# EAGLE board Modulator_V1p2 (EAGLE 9.6.2), part 1 of 2
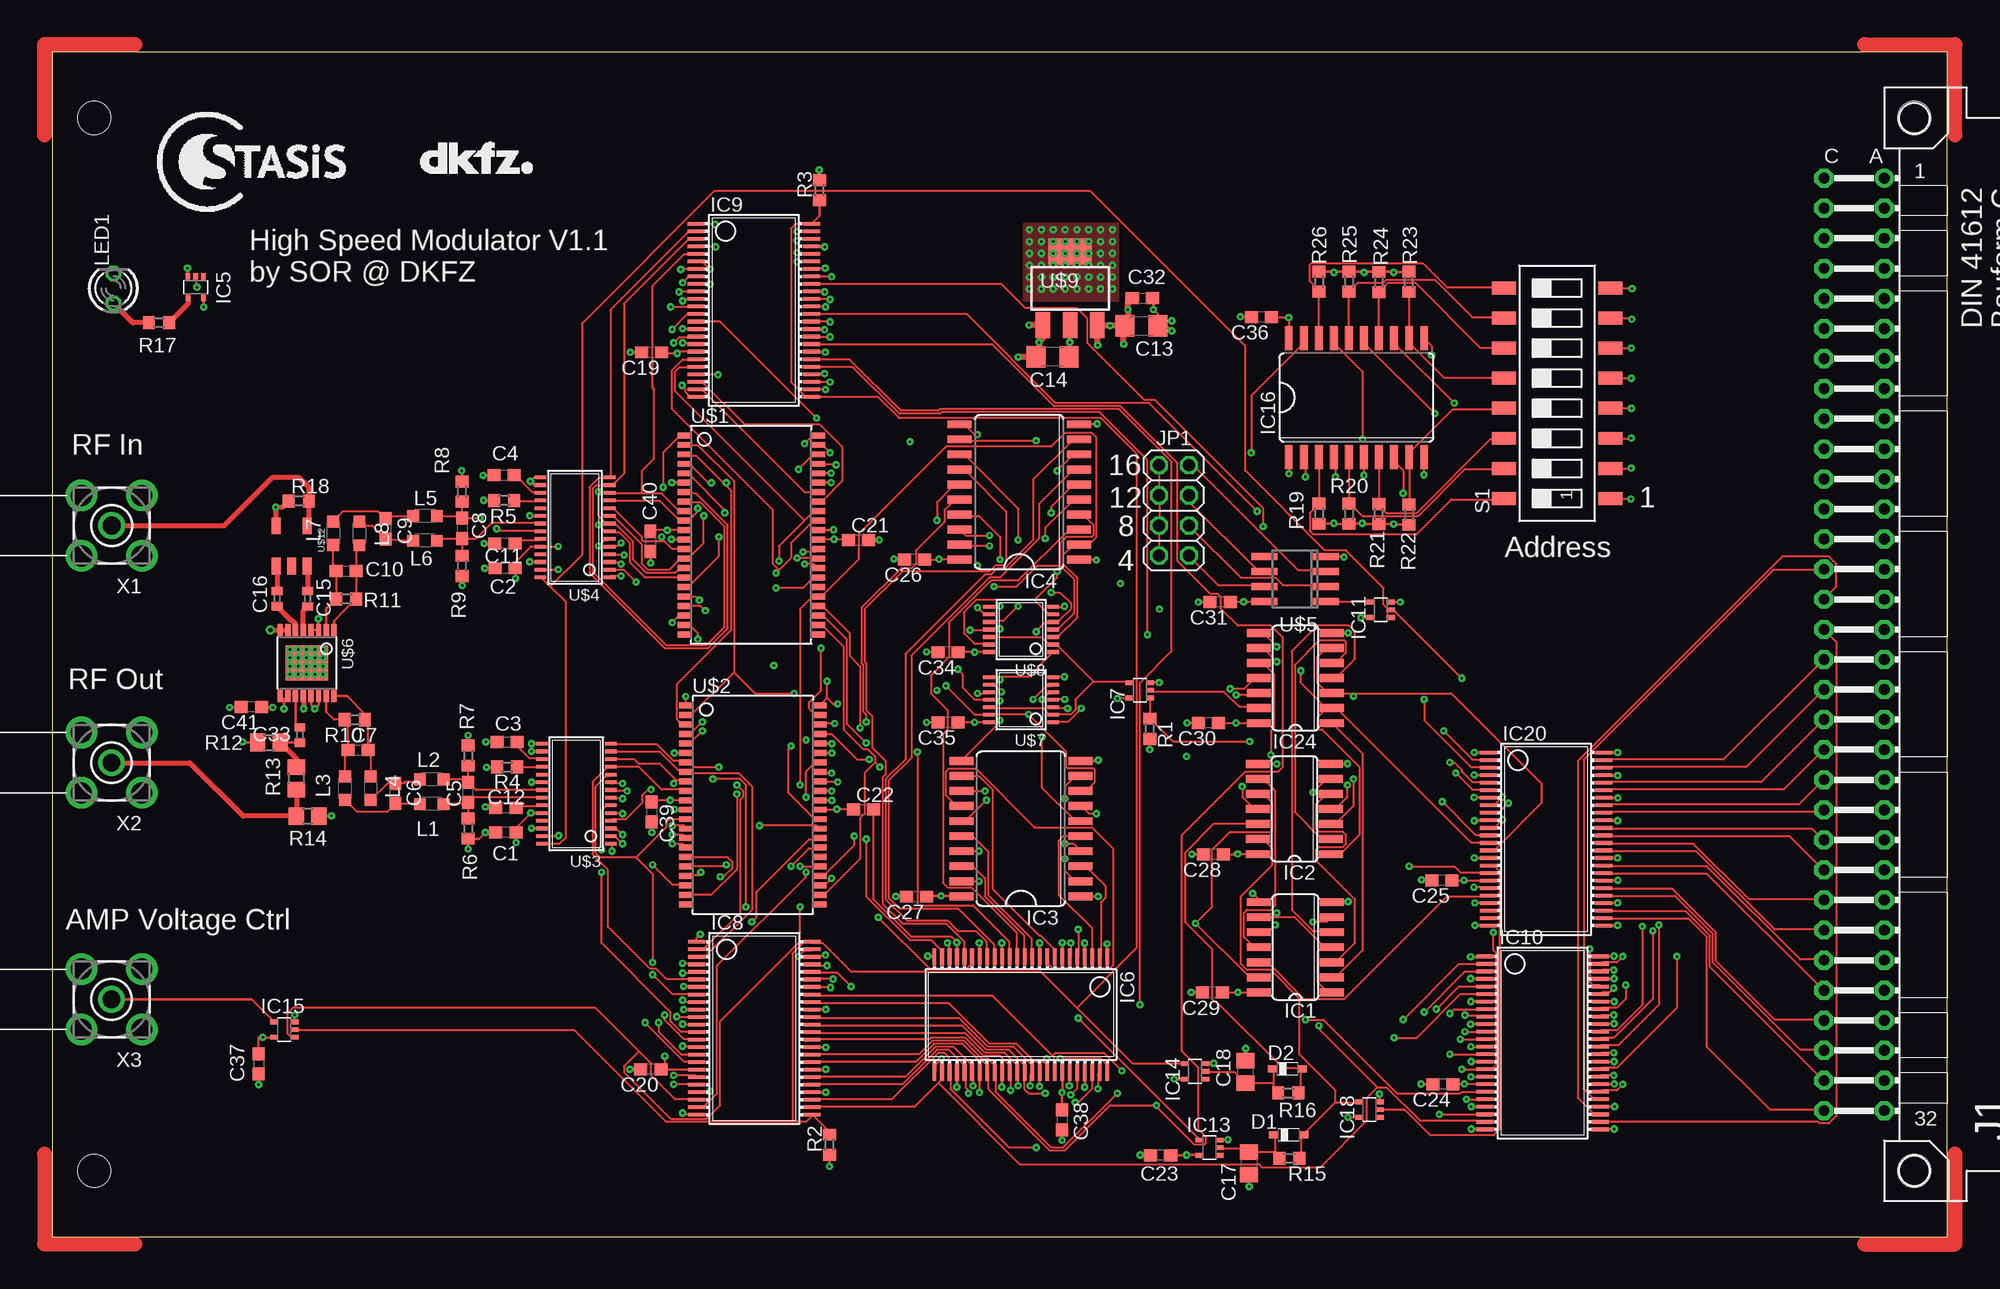
[diagram p5: board, top side]
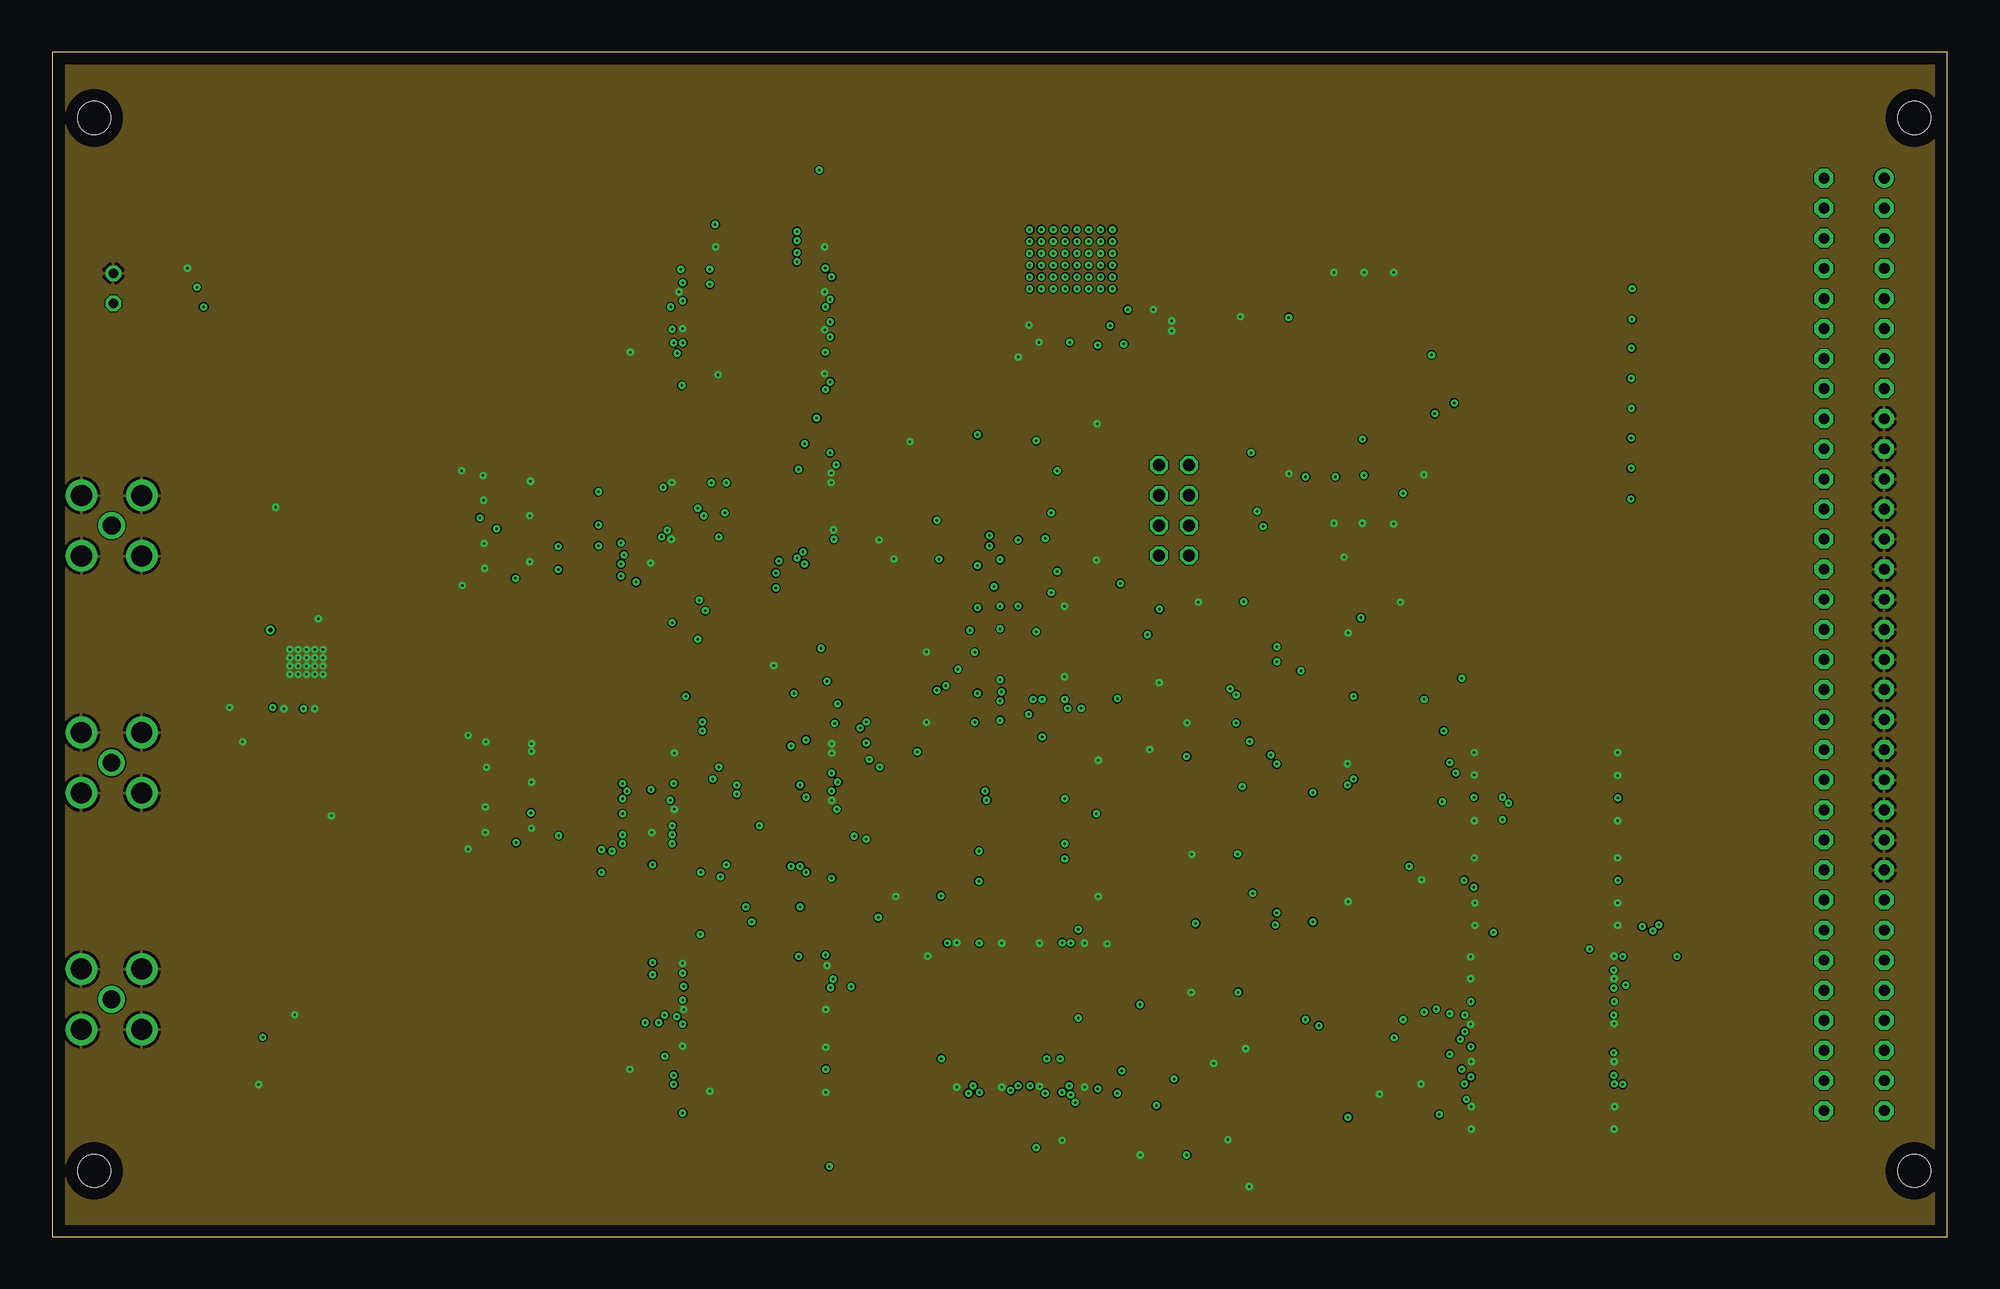
[diagram p6: board, inner layer GND]
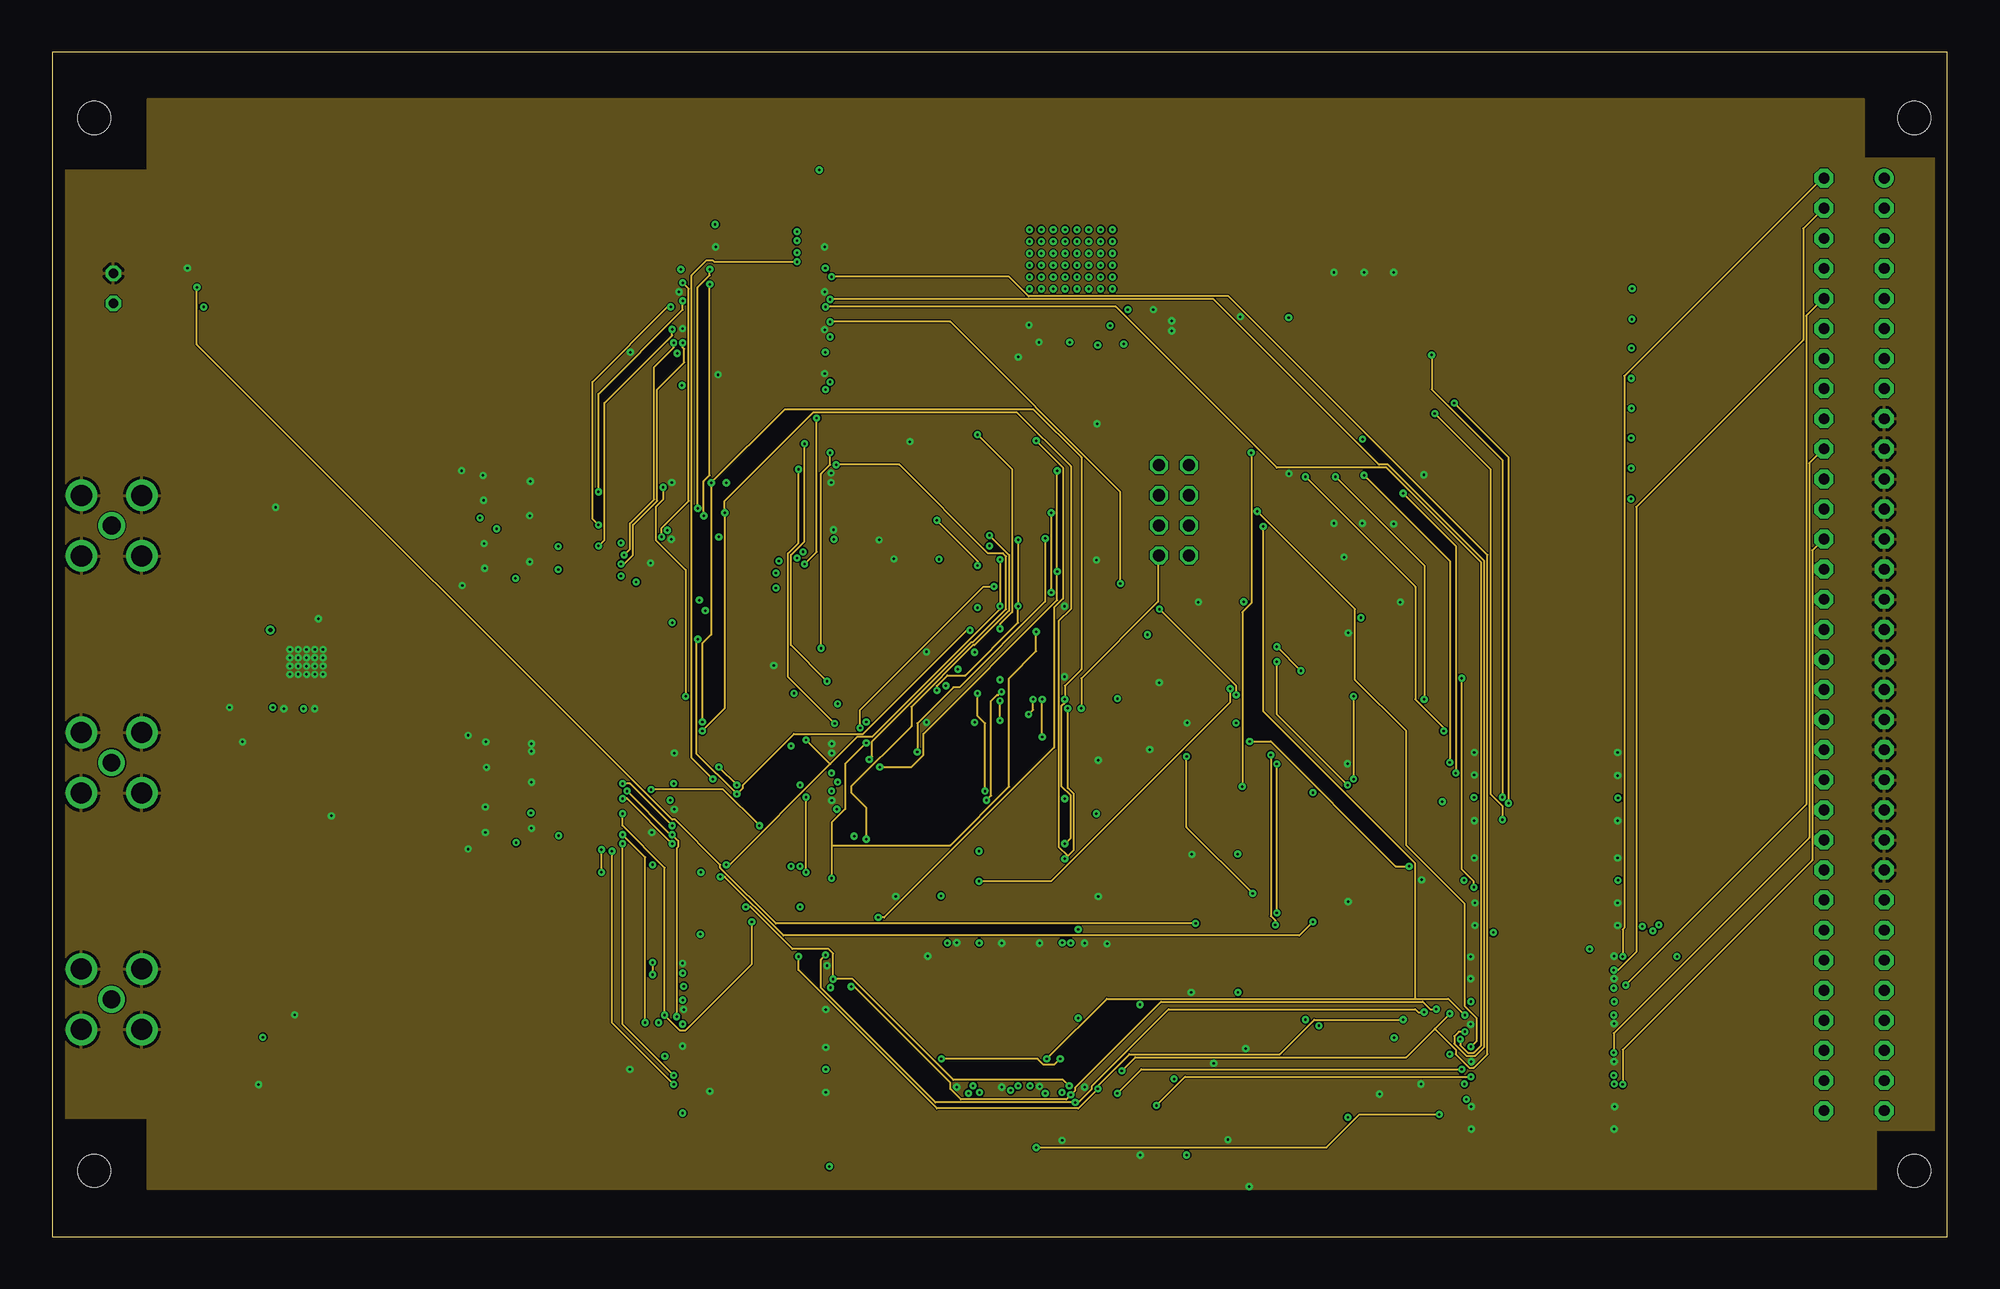
[diagram p7: board, inner layer Route3]
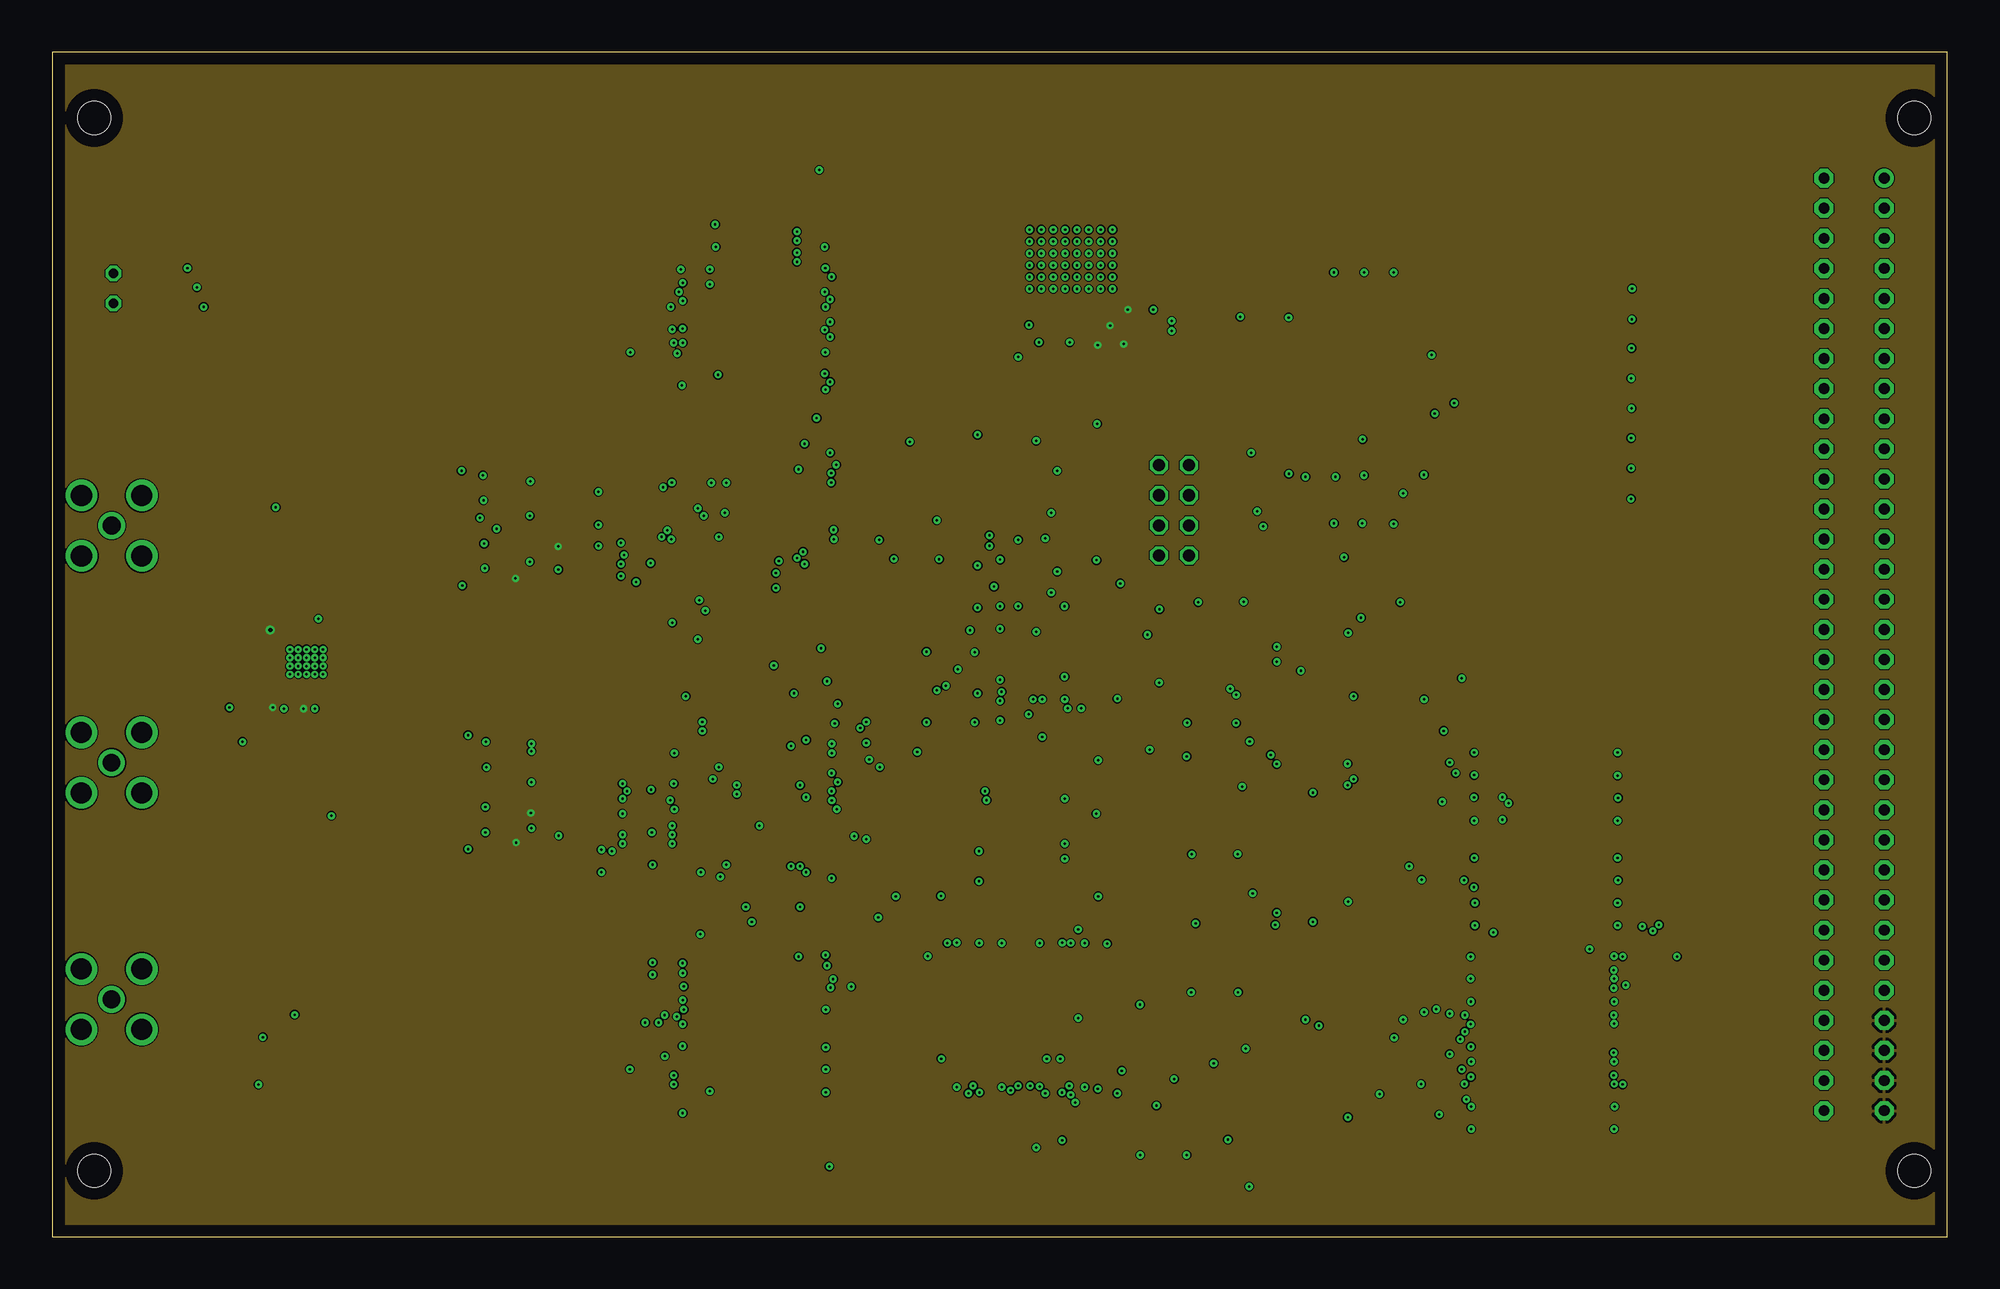
[diagram p8: board, inner layer 5V]
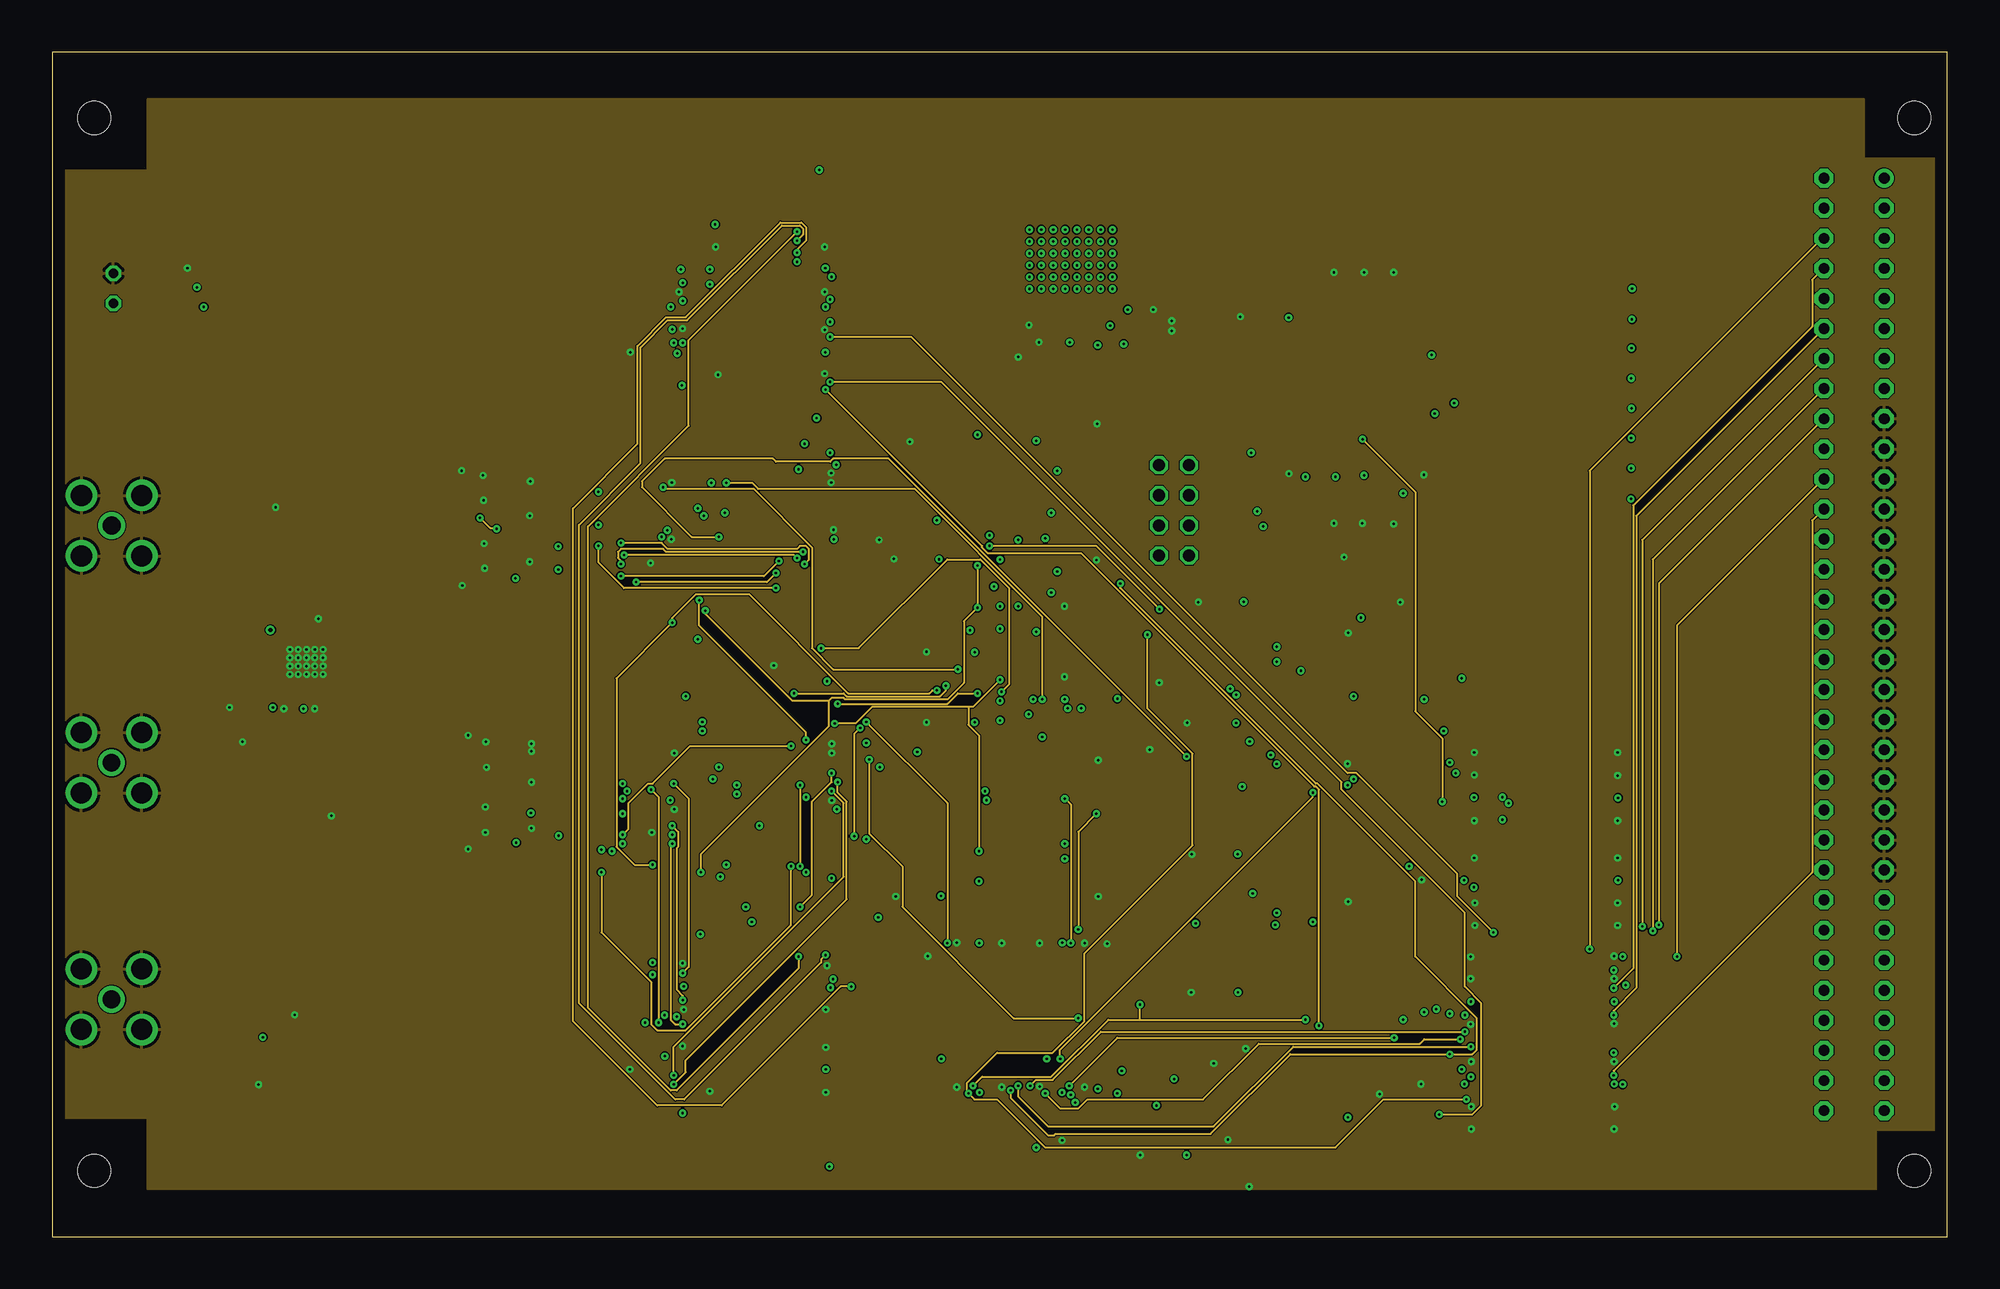
[diagram p9: board, inner layer Route15]
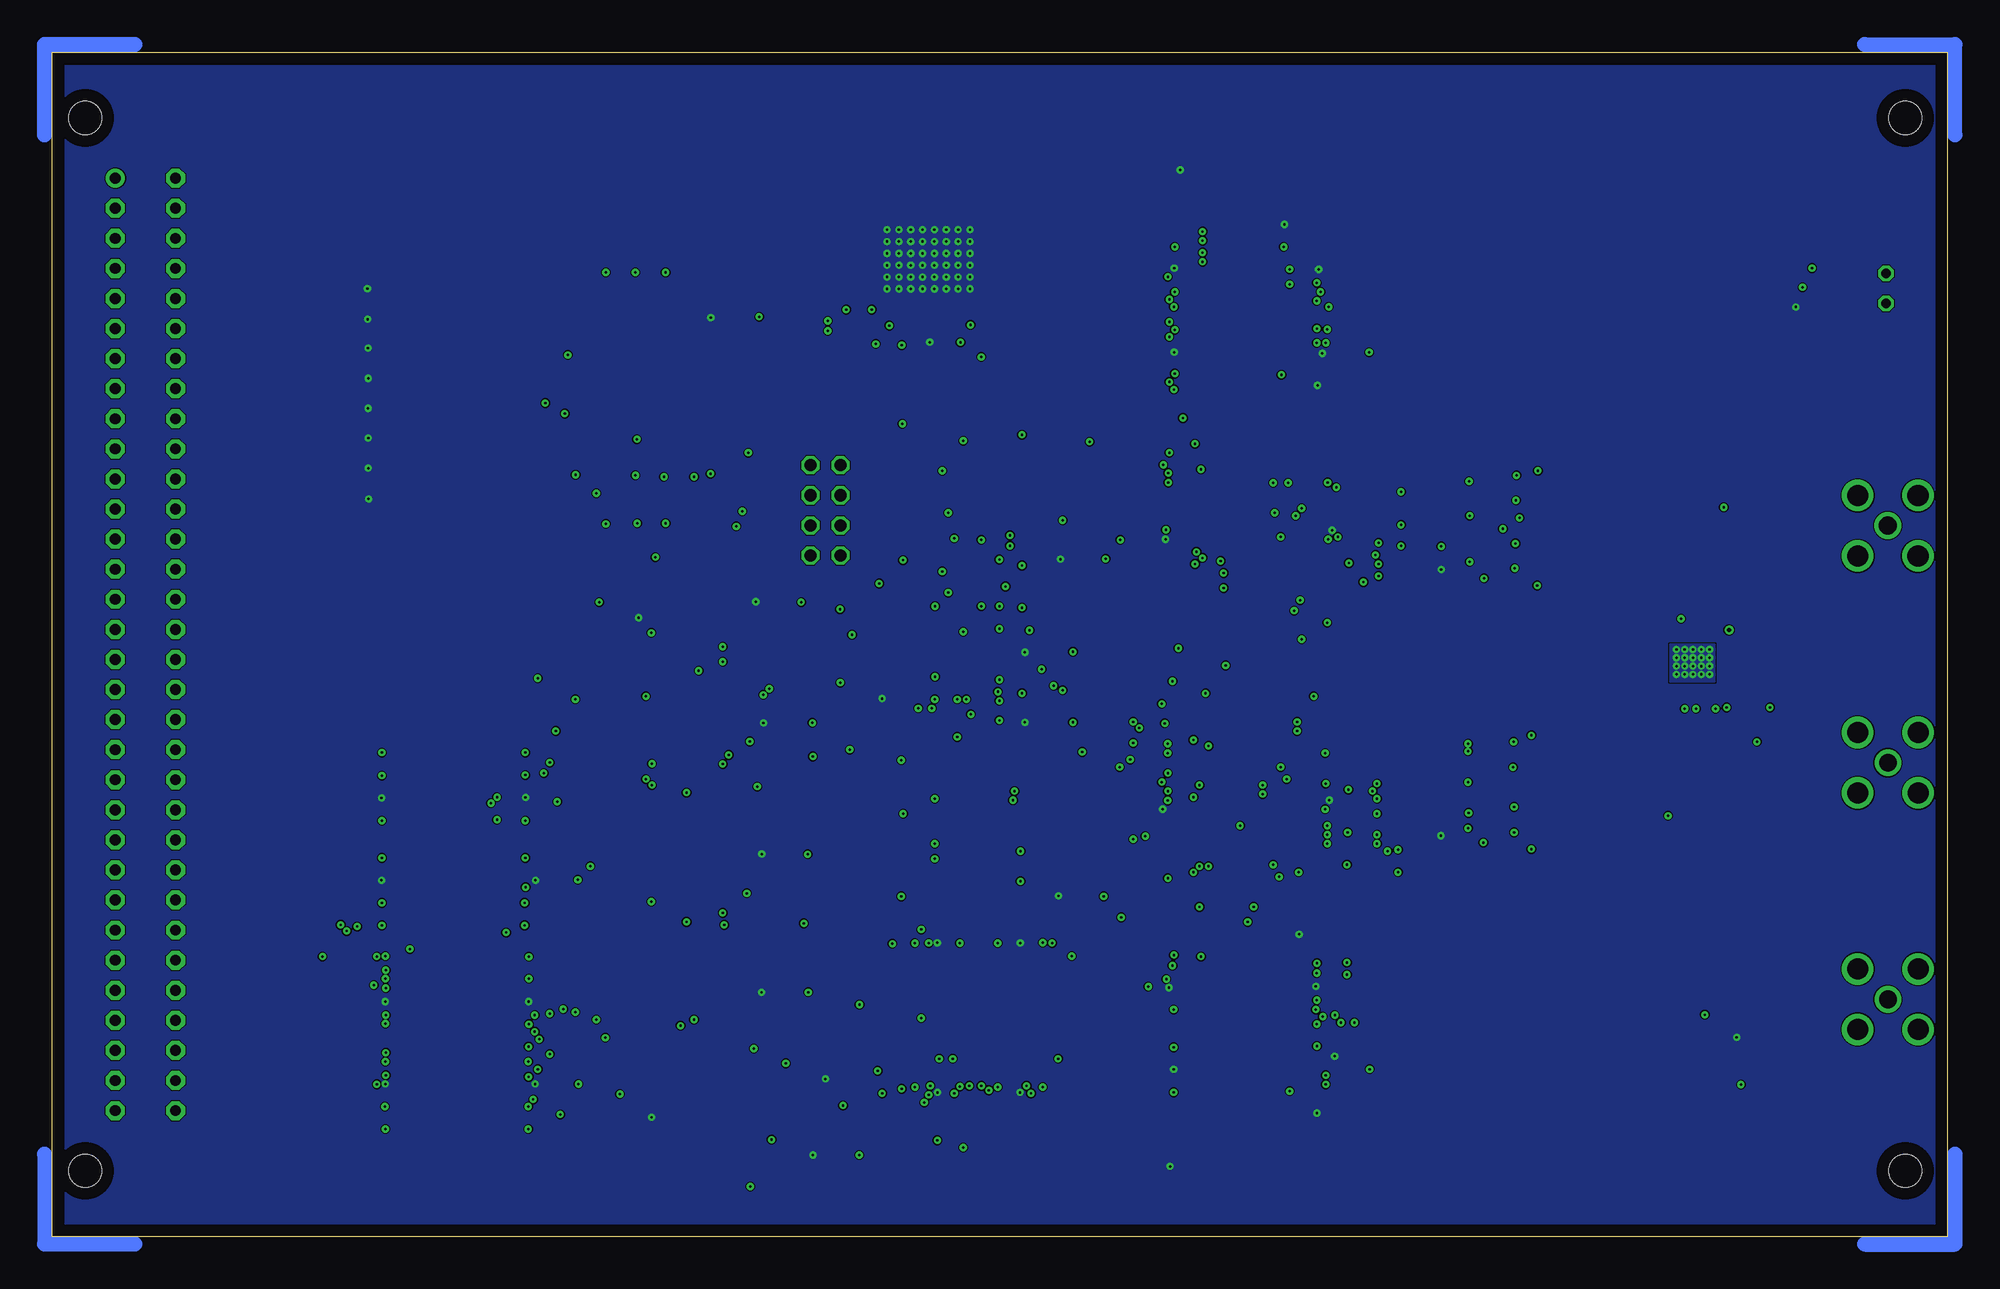
[diagram p10: board, bottom side, seen from below]

Size 160.02 x 100.03 mm. Coordinates in mm from the lower left corner, seen from the top.
Copper layers (1+2*3+14*15+16): Top 0.035mm / dielectric 0.23mm / GND 0.035mm / dielectric 0.3mm / Route3 0.035mm / dielectric 0.34mm / 5V 0.035mm / dielectric 0.3mm / Route15 0.035mm / dielectric 0.23mm / VCC 0.035mm
Design rules "default *": minimum track width 6mil, minimum drill 0.2mm, track to track 4mil, track to pad 4mil, pad to pad 4mil, via to via 4mil, smd to smd 0mil, copper to edge 40mil, drill to drill 6mil, minimum pad ring 10mil, minimum via ring 8mil, stop-mask expansion 4mil, vias tented up to drill 100mil, thermal gap 10mil

## Footprints (pad centres in the part's own frame; a part is rotated, then mirrored left to right if it is on the bottom)
C0603 = smd 1.1 x 1: 1 -0.85,0; 2 0.85,0
C1206 = smd 1.6 x 1.8: 1 -1.4,0; 2 1.4,0
C0402 = smd 0.7 x 0.9: 1 -0.65,0; 2 0.65,0
C0805 = smd 1.3 x 1.5: 1 -0.95,0; 2 0.95,0
SOD323_ST = smd 0.8 x 0.6: A 1.25,0; C -1.25,0
SO14 = smd 0.66 x 2.032: 1 -3.81,-3.073; 2 -2.54,-3.073; 3 -1.27,-3.073; 4 0,-3.073; 5 1.27,-3.073; 6 2.54,-3.073; 7 3.81,-3.073; 8 3.81,3.073; 9 2.54,3.073; 10 1.27,3.073; 11 0,3.073; 12 -1.27,3.073; 13 -2.54,3.073; 14 -3.81,3.073
SO20W = smd 0.66 x 2.032: 1 -5.715,-5.029; 2 -4.445,-5.029; 3 -3.175,-5.029; 4 -1.905,-5.029; 5 -0.635,-5.029; 6 0.635,-5.029; 7 1.905,-5.029; 8 3.175,-5.029; 9 4.445,-5.029; 10 5.715,-5.029; 11 5.715,5.029; 12 4.445,5.029; 13 3.175,5.029; 14 1.905,5.029; 15 0.635,5.029; 16 -0.635,5.029; 17 -1.905,5.029; 18 -3.175,5.029; 19 -4.445,5.029; 20 -5.715,5.029
SC70-5 = smd 0.4 x 0.7: 1 -0.65,-0.85; 2 0,-0.85; 3 0.65,-0.85; 4 0.65,0.85; 5 -0.65,0.85
SSOP48DL = smd 0.305 x 1.422: 1 -6.985,-4.877; 2 -6.35,-4.877; 3 -5.715,-4.877; 4 -5.08,-4.877; 5 -4.445,-4.877; 6 -3.81,-4.877; 7 -3.175,-4.877; 8 -2.54,-4.877; 9 -1.905,-4.877; 10 -1.27,-4.877; 11 -0.635,-4.877; 12 0,-4.877; 13 0.635,-4.877; 14 1.27,-4.877; 15 1.905,-4.877; 16 2.54,-4.877; 17 3.175,-4.877; 18 3.81,-4.877; 19 4.445,-4.877; 20 5.08,-4.877; 21 5.715,-4.877; 22 6.35,-4.877; 23 6.985,-4.877; 24 7.62,-4.877; 25 7.62,4.877; 26 6.985,4.877; 27 6.35,4.877; 28 5.715,4.877; 29 5.08,4.877; 30 4.445,4.877; 31 3.81,4.877; 32 3.175,4.877; 33 2.54,4.877; 34 1.905,4.877; 35 1.27,4.877; 36 0.635,4.877; 37 0,4.877; 38 -0.635,4.877; 39 -1.27,4.877; 40 -1.905,4.877; 41 -2.54,4.877; 42 -3.175,4.877; 43 -3.81,4.877; 44 -4.445,4.877; 45 -5.08,4.877; 46 -5.715,4.877; 47 -6.35,4.877; 48 -6.985,4.877
VG64B = drill 0.914 pad 1.6: A1 154.94,39.37 | drill 0.914 pad 1.6 octagon: A2 154.94,36.83; A3 154.94,34.29; A4 154.94,31.75; A5 154.94,29.21; A6 154.94,26.67; A7 154.94,24.13; A8 154.94,21.59; A9 154.94,19.05; A10 154.94,16.51; A11 154.94,13.97; A12 154.94,11.43; A13 154.94,8.89; A14 154.94,6.35; A15 154.94,3.81; A16 154.94,1.27; A17 154.94,-1.27; A18 154.94,-3.81; A19 154.94,-6.35; A20 154.94,-8.89; A21 154.94,-11.43; A22 154.94,-13.97; A23 154.94,-16.51; A24 154.94,-19.05; A25 154.94,-21.59; A26 154.94,-24.13; A27 154.94,-26.67; A28 154.94,-29.21; A29 154.94,-31.75; A30 154.94,-34.29; A31 154.94,-36.83; A32 154.94,-39.37; C1 149.86,39.37; C2 149.86,36.83; C3 149.86,34.29; C4 149.86,31.75; C5 149.86,29.21; C6 149.86,26.67; C7 149.86,24.13; C8 149.86,21.59; C9 149.86,19.05; C10 149.86,16.51; C11 149.86,13.97; C12 149.86,11.43; C13 149.86,8.89; C14 149.86,6.35; C15 149.86,3.81; C16 149.86,1.27; C17 149.86,-1.27; C18 149.86,-3.81; C19 149.86,-6.35; C20 149.86,-8.89; C21 149.86,-11.43; C22 149.86,-13.97; C23 149.86,-16.51; C24 149.86,-19.05; C25 149.86,-21.59; C26 149.86,-24.13; C27 149.86,-26.67; C28 149.86,-29.21; C29 149.86,-31.75; C30 149.86,-34.29; C31 149.86,-36.83; C32 149.86,-39.37 | hole 2.794: 157.48,44.45; 157.48,-44.45; 3.81,-44.45; 3.81,44.45
2X04 = drill 1.016 octagon: 1 -3.81,-1.27; 2 -3.81,1.27; 3 -1.27,-1.27; 4 -1.27,1.27; 5 1.27,-1.27; 6 1.27,1.27; 7 3.81,-1.27; 8 3.81,1.27
L2012C = smd 1 x 1: 1 -1,0; 2 1,0
LED3MM = drill 0.813 octagon: A -1.27,0; K 1.27,0
R0603 = smd 1 x 1.1: 1 -0.85,0; 2 0.85,0
R0805 = smd 1.3 x 1.5: 1 -0.95,0; 2 0.95,0
SMS-008 = smd 1.092 x 2.007: 1 -8.89,-4.496; 2 -6.35,-4.496; 3 -3.81,-4.496; 4 -1.27,-4.496; 5 1.27,-4.496; 6 3.81,-4.496; 7 6.35,-4.496; 8 8.89,-4.496; 9 8.89,4.496; 10 6.35,4.496; 11 3.81,4.496; 12 1.27,4.496; 13 -1.27,4.496; 14 -3.81,4.496; 15 -6.35,4.496; 16 -8.89,4.496
TSOPII-Z44 = smd 0.5 x 1.2: 1 -8.4,-5.627; 2 -7.6,-5.627; 3 -6.8,-5.627; 4 -6,-5.627; 5 -5.2,-5.627; 6 -4.4,-5.627; 7 -3.6,-5.627; 8 -2.8,-5.627; 9 -2,-5.627; 10 -1.2,-5.627; 11 -0.4,-5.627; 12 0.4,-5.627; 13 1.2,-5.627; 14 2,-5.627; 15 2.8,-5.627; 16 3.6,-5.627; 17 4.4,-5.627; 18 5.2,-5.627; 19 6,-5.627; 20 6.8,-5.627; 21 7.6,-5.627; 22 8.4,-5.627; 23 8.4,5.627; 24 7.6,5.627; 25 6.8,5.627; 26 6,5.627; 27 5.2,5.627; 28 4.4,5.627; 29 3.6,5.627; 30 2.8,5.627; 31 2,5.627; 32 1.2,5.627; 33 0.4,5.627; 34 -0.4,5.627; 35 -1.2,5.627; 36 -2,5.627; 37 -2.8,5.627; 38 -3.6,5.627; 39 -4.4,5.627; 40 -5.2,5.627; 41 -6,5.627; 42 -6.8,5.627; 43 -7.6,5.627; 44 -8.4,5.627
TSSOP28 = smd 0.305 x 0.991: 1 -4.225,-2.918; 2 -3.575,-2.918; 3 -2.925,-2.918; 4 -2.275,-2.918; 5 -1.625,-2.918; 6 -0.975,-2.918; 7 -0.325,-2.918; 8 0.325,-2.918; 9 0.975,-2.918; 10 1.625,-2.918; 11 2.275,-2.918; 12 2.925,-2.918; 13 3.575,-2.918; 14 4.225,-2.918; 15 4.225,2.918; 16 3.575,2.918; 17 2.925,2.918; 18 2.275,2.918; 19 1.625,2.918; 20 0.975,2.918; 21 0.325,2.918; 22 -0.325,2.918; 23 -0.975,2.918; 24 -1.625,2.918; 25 -2.275,2.918; 26 -2.925,2.918; 27 -3.575,2.918; 28 -4.225,2.918
SO-08 = smd 0.6 x 2.2: 1 -1.905,-2.6; 2 -0.635,-2.6; 3 0.635,-2.6; 4 1.905,-2.6; 5 1.905,2.6; 6 0.635,2.6; 7 -0.635,2.6; 8 -1.905,2.6
TSSOP16EXP = smd 0.45 x 1.05: 1 -2.275,-2.768; 2 -1.625,-2.768; 3 -0.975,-2.768; 4 -0.325,-2.768; 5 0.325,-2.768; 6 0.975,-2.768; 7 1.625,-2.768; 8 2.275,-2.768; 9 2.275,2.768; 10 1.625,2.768; 11 0.975,2.768; 12 0.325,2.768; 13 -0.325,2.768; 14 -0.975,2.768; 15 -1.625,2.768; 16 -2.275,2.768 | smd 3.58 x 2.94: EXP 0,0
TSSOP14 = smd 0.305 x 0.991: 1 -1.905,-2.718; 2 -1.27,-2.718; 3 -0.635,-2.718; 4 0,-2.718; 5 0.635,-2.718; 6 1.27,-2.718; 7 1.905,-2.718; 8 1.905,2.718; 9 1.27,2.718; 10 0.635,2.718; 11 0,2.718; 12 -0.635,2.718; 13 -1.27,2.718; 14 -1.905,2.718
SOT223 = smd 1.219 x 2.235: 1 -2.311,-3.099; 2 0,-3.099; 3 2.311,-3.099 | smd 3.6 x 2.2: 4 0,3.099
ETC1-1-13 = smd 1.4 x 0.76: P$1 1.7,1.3; P$2 1.7,0; P$3 1.7,-1.3; P$4 -1.7,-1.3; P$5 -1.7,1.3
BU-SMA-H = drill 1.5: 1 0,0 | drill 1.778: 2 -2.55,2.55; 3 2.55,2.55; 4 2.55,-2.55; 5 -2.55,-2.55

## Placement (x,y rotation side)
C1  100nF  [C0603]  38.31,34.12 180 top
C2  100nF  [C0603]  38.25,56.44 180 top
C3  100nF  [C0603]  38.41,41.78 0 top
C4  100nF  [C0603]  38.17,64.3 0 top
C5  110pF  [C0603]  35.13,37.52 90 top
C6  270pF  [C0603]  28.98,37.43 90 top
C7  220pF  [C0603]  25.85,41.09 0 top
C8  110pF  [C0603]  34.61,59.81 270 top
C9  270pF  [C0603]  28.17,59.77 270 top
C10  220pF  [C0603]  24.83,56.21 0 top
C11  100nF  [C0603]  38.23,58.53 180 top
C12  100nF  [C0603]  38.31,36.21 180 top
C13  10µF  [C1206]  91.97,76.91 0 top
C14  22µF  [C1206]  84.46,74.29 180 top
C15  10nF  [C0402]  21.58,53.86 270 top
C16  10nF  [C0402]  19,53.87 270 top
C17  1nF  [C0805]  101.05,6.19 270 top
C18  1nF  [C0805]  100.77,13.91 90 top
C19  100nF  [C0603]  50.63,74.67 180 top
C20  100nF  [C0603]  50.55,14.13 180 top
C21  10nF  [C0603]  68.1,58.83 0 top
C22  10nF  [C0603]  68.51,36.07 0 top
C23  10nF  [C0603]  93.6,6.87 180 top
C24  10nF  [C0603]  117.43,12.87 180 top
C25  10nF  [C0603]  117.36,30.09 180 top
C26  10nF  [C0603]  72.83,57.19 180 top
C27  10nF  [C0603]  73,28.71 180 top
C28  10nF  [C0603]  98.05,32.27 180 top
C29  10nF  [C0603]  97.96,20.61 180 top
C30  10nF  [C0603]  97.63,43.37 180 top
C31  10nF  [C0603]  98.63,53.58 180 top
C32  10nF  [C0603]  92.05,79.25 0 top
C33  10nF  [C0402]  20.93,42.35 270 top
C34  10nF  [C0603]  75.65,49.35 180 top
C35  10nF  [C0603]  75.65,43.43 180 top
C36  10nF  [C0603]  102.11,77.65 180 top
C37  10nF  [C0603]  17.43,14.59 270 top
C38  10nF  [C0603]  85.27,9.85 270 top
C39  10nF  [C0603]  50.61,35.85 270 top
C40  10nF  [C0603]  50.51,58.71 270 top
C41  10nF  [C0603]  16.83,44.73 180 top
D1  BAT60J  [SOD323_ST]  104.41,8.6 0 top
D2  BAT60J  [SOD323_ST]  104.29,14.16 0 top
IC1  74ALVC00  [SO14]  104.98,24.44 90 top
IC2  SN74LVC04ANS  [SO14]  104.9,36.11 90 top
IC3  74HC688DW  [SO20W]  81.8,34.45 90 top
IC4  74HC688DW  [SO20W]  81.66,62.88 90 top
IC5  74LVC1G17DCK  [SC70-5]  12.13,80.18 180 top
IC6  SN74LVC16373  [SSOP48DL]  82.12,18.74 180 top
IC7  SN74LVC1G32IDCKREP  [SC70-5]  91.84,46.13 90 top
IC8  SN74CB3Q16245DLR  [SSOP48DL]  59.3,17.91 270 top
IC9  SN74CB3Q16245DLR  [SSOP48DL]  59.24,78.54 270 top
IC10  SN74LVCH16244ADLR  [SSOP48DL]  125.86,16.68 270 top
IC11  74LVC1G04DCK  [SC70-5]  112.18,52.93 90 top
IC13  74LVC1G17DCK  [SC70-5]  97.72,7.51 90 top
IC14  74LVC1G17DCK  [SC70-5]  96.5,13.95 90 top
IC15  74LVC1G08DCK  [SC70-5]  19.6,17.49 90 top
IC16  74HC688DW  [SO20W]  110.13,70.86 0 top
IC18  74LVC1G17DCK  [SC70-5]  111.23,10.73 90 top
IC20  SN74LVCH16244ADLR  [SSOP48DL]  126.14,33.88 270 top
IC24  SN74LVC02AD  [SO14]  104.98,47.17 90 top
J1  BUS  [VG64B]  -0.25,50.01 0 top
JP1  PINHD-2X4  [2X04]  94.73,61.33 90 top
L1  1uH  [L2012C]  32.05,36.52 180 top
L2  1uH  [L2012C]  32.05,38.6 180 top
L3  1.5uH  [L2012C]  24.75,37.87 90 top
L4  1.5uH  [L2012C]  26.91,37.86 90 top
L5  1uH  [L2012C]  31.49,60.84 180 top
L6  1uH  [L2012C]  31.49,58.76 180 top
L7  1.5uH  [L2012C]  23.73,59.39 270 top
L8  1.5uH  [L2012C]  25.95,59.38 270 top
LED1  10mA 2.2-2.4V  [LED3MM]  5.18,80.08 90 top
R1  100k  [R0603]  92.69,42.88 270 top
R2  100k  [R0603]  65.63,7.77 90 top
R3  100k  [R0603]  64.79,88.36 90 top
R4  2k  [R0603]  38.41,39.65 180 top
R5  2k  [R0603]  38.16,62.17 180 top
R6  140  [R0603]  35.13,34.45 270 top
R7  140  [R0603]  35.13,40.62 270 top
R8  140  [R0603]  34.61,62.91 90 top
R9  140  [R0603]  34.61,56.64 90 top
R10  220  [R0603]  25.56,43.65 180 top
R11  220  [R0603]  24.82,53.85 180 top
R12  NP  [R0805]  18.31,41.73 0 top
R13  0  [R0805]  20.63,38.7 90 top
R14  NP  [R0805]  21.57,35.51 0 top
R15  1k  [R0603]  104.48,6.61 180 top
R16  1k  [R0603]  104.38,12.13 180 top
R17  120  [R0603]  9.03,77.18 0 top
R18  50  [R0603]  20.83,62.13 0 top
R19  100k  [R0603]  106.97,61.05 90 top
R20  100k  [R0603]  109.51,61.04 90 top
R21  100k  [R0603]  112.01,61.01 90 top
R22  100k  [R0603]  114.57,60.96 90 top
R23  100k  [R0603]  114.55,80.63 270 top
R24  100k  [R0603]  112.03,80.62 270 top
R25  100k  [R0603]  109.51,80.65 270 top
R26  100k  [R0603]  106.97,80.64 270 top
S1  SWS008  [SMS-008]  127.08,71.22 90 top
U$1  SRAM_64K_16BIT  [TSOPII-Z44]  59.02,59.26 270 top
U$2  SRAM_64K_16BIT  [TSOPII-Z44]  59.16,36.45 270 top
U$3  AD9754  [TSSOP28]  44.26,37.39 90 top
U$4  AD9754  [TSSOP28]  44.15,59.89 90 top
U$5  DS1100LZ-20LZ  [SO-08]  104.95,55.53 90 top
U$6  AD8345E  [TSSOP16EXP]  21.53,48.43 180 top
U$7  74LV393PW  [TSSOP14]  81.82,45.34 90 top
U$8  74LV393PW  [TSSOP14]  81.82,51.27 90 top
U$9  AZ1117IH-3.3TRG1  [SOT223]  85.95,80.07 0 top
U$10  [LOGO_DKFZ]  31.13,89.73 0 top
U$11  [LOGO_STASIS]  17.83,90.53 0 top
U$12  ETC1-1-13  [ETC1-1-13]  20.23,58.33 270 top
X1  SMA_CON-H  [BU-SMA-H]  5.03,60.04 180 top
X2  SMA_CON-H  [BU-SMA-H]  5.02,40.02 180 top
X3  SMA_CON-H  [BU-SMA-H]  5.02,20.04 180 top

## Tracks (layer width: path | path; a pad name or v marks a point on that pad's centre or on a via)
5V  (via drill 0.2, 0.35)
  Top 0.152: U$4.24 41.23,58.28 | 41.23,58.28 v42.73,58.28 | 41.23,58.28 40.44,58.28 39.1,56.94 C2.1 39.13,56.41 v39.13,55.58 | 90.83,78.88 C32.1 | 90.83,77.17 C13.1 90.43,76.91 90.48,76.86 | 89.35,76.91 v89.33,76.93 | 88.3,76.93 88.29,76.94 | 88.29,76.94 U$9.3 | 88.28,76.93 88.29,76.94 | C41.1 18.58,44.73 v18.63,44.68
  Top 0.203: U$3.24 41.32,35.78 v40.43,35.78 39.16,34.51 C1.1 39.18,34.1 v39.18,33.28
  Top 0.406: U$6.7 U$6.8 18.46,51.2 v18.43,51.23 | U$6.12 21.23,45.64 v21.23,44.58
  Top 0.508: 90.83,78.88 v90.83,78.28 90.83,77.17 | 90.43,76.91 89.35,76.91 | v89.33,76.93 88.3,76.93 | v88.28,75.28 88.28,76.93 | v90.48,75.38 90.48,76.86
  pour 5V: 1.03,99.03 1.03,1.03 159.03,1.03 159.03,99.03
A0  (via drill 0.2)
  Top 0.152: v85.75,44.61 84.61,44.61 U$7.3 | v85.5,31.91 85.5,30.89 86.26,30.13 86.77,30.13 IC3.2 | v54.89,42.7 53.87,41.69 53.62,41.69 U$2.5 | v56.8,61.12 56.8,61.37 53.75,64.42 53.49,64.42 U$1.5
  Route3 0.152: v85.75,44.61 85.75,37.88 86.26,37.37 86.26,32.67 85.75,32.16 | v85.5,31.91 85.75,32.16 | v54.89,42.7 56.8,44.61 v56.8,61.12 56.8,62.14 64.29,69.63 81.43,69.63 86,65.06 86,52.99 84.99,51.98 84.99,32.93 85.75,32.16
A1  (via drill 0.2)
  Top 0.152: v85.5,45.37 84.61,45.37 U$7.4 | v85.5,33.18 86.26,33.18 86.77,32.67 IC3.4 | v54.89,43.47 54,42.58 53.62,42.58 U$2.4 | v55.65,63.66 55.4,63.66 53.87,65.18 53.49,65.18 U$1.4
  Route3 0.152: v85.5,33.18 86,33.69 86,37.24 85.24,38.01 85.24,44.86 85.5,45.12 v85.5,45.37 85.5,46.51 86.89,47.91 86.89,65.82 82.83,69.88 61.88,69.88 v55.65,63.66 55.65,50.83 54.89,50.07 v54.89,43.47
A2  (via drill 0.2)
  Top 0.152: v83.59,45.37 84.1,45.88 84.48,45.88 U$7.5 | v83.59,42.2 83.59,37.88 86.26,35.21 86.77,35.21 IC3.6 | 56.8,63.53 54.38,65.95 53.49,65.95 U$1.3 | 56.8,63.53 57.3,63.02 57.3,51.21 52.73,46.64 52.73,43.72 53.11,43.34 53.49,43.34 U$2.3 | 56.8,63.53 v56.92,63.66
  Route3 0.152: v83.59,42.2 v83.59,45.37
  Route15 0.152: v83.59,45.37 83.59,52.36 72.8,63.15 59.59,63.15 59.08,63.66 v56.92,63.66
A3  (via drill 0.2)
  Top 0.152: IC3.8 86.89,37.75 87.4,37.75 88.04,38.39 88.04,39.4 87.91,39.53 85.75,39.53 85.62,39.66 85.62,40.93 v82.45,44.1 79.15,44.1 U$7.13 79.02,44.1 77.88,44.1 v75.46,46.51 | v82.83,45.37 83.97,46.51 84.48,46.51 U$7.6 | 57.56,47.66 54,44.1 53.62,44.1 U$2.2 | 57.56,47.66 57.56,63.79 54.51,66.83 53.49,66.83 U$1.2 | v62.64,45.88 59.34,45.88 57.56,47.66
  Route3 0.152: v82.83,45.37 82.83,44.48 v82.45,44.1
  Route15 0.152: v75.46,46.51 75.46,46.13 74.96,45.63 67.08,45.63 66.83,45.88 v62.64,45.88
A4  (via drill 0.2)
  Top 0.152: v80.04,45.24 79.15,45.24 U$7.11 79.02,45.37 77.88,45.37 76.86,46.39 76.86,47.53 v76.48,47.91 | v80.04,43.59 79.78,43.34 79.78,43.21 76.86,40.29 IC3.11 | v53.49,45.63 53.49,44.86 U$2.1 | v51.59,63.28 51.59,66.2 52.99,67.6 53.37,67.6 U$1.1
  Route3 0.152: v80.04,43.59 v80.04,45.24 | v53.49,45.63 53.49,56.29 50.95,58.83 50.95,61.63 51.59,62.26 v51.59,63.28
  Route15 0.152: v76.48,47.91 65.94,47.91 64.16,49.69 64.16,58.2 59.21,63.15 51.72,63.15 v51.59,63.28
A5  (via drill 0.2)
  Top 0.152: v78.13,45.88 79.02,45.88 U$7.10 | v78.77,37.62 76.86,37.62 IC3.13 | v63.53,66.96 64.16,67.6 64.54,67.6 U$1.44 | 65.43,45.5 v65.43,46.9 | 65.43,45.5 64.8,44.86 U$2.44 | v66.32,44.99 65.94,44.99 65.43,45.5
  Route3 0.152: v78.13,45.88 78.13,43.97 78.77,43.34 v78.77,37.62 | v63.53,66.96 63.53,58.71 62.38,57.56 62.38,49.94 v65.43,46.9
  Route15 0.152: v78.13,45.88 76.48,45.88 75.59,44.99 v66.32,44.99
A6  (via drill 0.2)
  Top 0.152: v80.16,46.01 79.66,46.51 79.15,46.51 U$7.9 | v78.89,36.86 77.24,35.21 76.86,35.21 IC3.15 | v65.69,66.2 65.05,66.83 64.67,66.83 U$1.43 | v64.92,49.69 64.92,46.13 63.91,45.12 63.91,44.61 64.41,44.1 64.67,44.1 U$2.43
  Route3 0.152: v80.16,46.01 79.91,45.75 79.78,45.75 79.27,45.24 79.27,37.24 v78.89,36.86 | v65.69,66.2 65.69,65.18 64.92,64.42 v64.92,49.69
  Route15 0.152: v80.16,46.01 80.8,46.64 80.8,54.77 78.38,57.18 75.59,57.18 68.1,49.69 v64.92,49.69
A7  (via drill 0.2)
  Top 0.152: 80.04,47.28 82.45,47.28 84.48,49.31 U$8.1 | 80.04,47.28 79.15,47.28 U$7.8 | v66.07,43.34 64.8,43.34 U$2.42 | 80.04,47.28 v80.04,47.02 | v63.02,64.8 64.16,65.95 64.54,65.95 U$1.42 | v78.26,32.54 76.86,32.54 IC3.17
  Route3 0.152: v63.02,64.8 63.02,58.58 62.13,57.69 62.13,47.28 v66.07,43.34
  Route15 0.152: v66.07,43.34 67.84,43.34 69.24,44.74 77.37,44.74 | 77.37,44.74 77.75,44.74 v80.04,47.02 | v78.26,32.54 78.26,42.32 77.37,43.21 77.37,44.74
A8  (via drill 0.2)
  Top 0.152: U$8.3 84.61,50.71 84.99,50.71 86.51,52.23 86.51,55.66 85.37,56.8 85.37,57.56 86.13,58.33 86.64,58.33 IC4.2 86.77,58.45 87.53,58.45 88.16,59.09 88.16,67.47 87.78,67.85 85.5,67.85 84.35,66.71 75.46,66.71 68.1,59.34 68.1,57.18 65.05,54.13 64.67,54.13 U$1.27 64.54,54.01 64.16,54.01 63.15,52.99 v63.15,38.13 | v63.15,31.27 64.67,31.27 U$2.27
  Route15 0.152: v63.15,38.13 v63.15,31.27
A9  (via drill 0.2)
  Top 0.152: 85.12,56.67 86.26,55.53 86.26,52.61 84.99,51.34 84.61,51.34 U$8.4 | 85.12,56.67 85.12,58.58 85.62,59.09 87.78,59.09 87.91,59.21 87.91,60.1 87.15,60.87 86.77,60.87 IC4.4 | v67.72,33.81 67.72,33.05 65.18,30.51 64.8,30.51 U$2.26 | v68.22,42.96 68.22,48.17 67.34,49.05 67.34,50.96 65.05,53.25 64.67,53.25 U$1.26 | 85.12,56.67 83.21,56.67 81.43,54.9 v79.53,54.9
  Route3 0.152: v79.53,54.9 78.64,54.9 68.22,44.48 v68.22,42.96
  Route15 0.152: v67.72,33.81 67.72,42.45 v68.22,42.96
A10  (via drill 0.2)
  Top 0.152: v84.35,54.39 85.12,54.39 86,53.5 86,52.99 84.99,51.98 84.61,51.98 U$8.5 84.48,51.85 83.85,51.85 v83.08,51.09 | v84.35,61.12 84.35,61.63 86.13,63.41 86.64,63.41 IC4.6 | v65.81,30.26 65.3,29.75 64.8,29.75 U$2.25 | v68.73,41.69 67.08,43.34 67.08,50.45 65.18,52.36 64.67,52.36 U$1.25
  Route3 0.152: v84.35,61.12 v84.35,54.39 | 65.81,33.05 65.81,34.96 66.95,36.1 66.95,39.91 v68.73,41.69 | 65.81,33.05 v65.81,30.26 | v83.08,51.09 83.08,49.44 80.8,47.15 80.8,38.01 75.84,33.05 65.81,33.05
A11  (via drill 0.2)
  Top 0.152: 82.96,53.75 78,53.75 76.99,52.74 76.99,50.96 77.88,50.07 79.02,50.07 U$8.13 | 82.96,53.75 84.1,52.61 84.48,52.61 U$8.6 | v84.86,64.68 86.13,65.95 86.64,65.95 IC4.8 | v84.86,56.17 84.86,55.66 82.96,53.75 | 69.49,40.04 68.61,39.15 68.61,35.72 68.22,35.34 68.22,31.91 65.18,28.86 U$2.24 | 69.49,40.04 69.49,40.55 68.86,41.18 68.48,41.18 66.83,42.83 66.83,49.82 65.05,51.59 64.67,51.59 U$1.24 | 69.49,40.04 v69.88,39.66
  Route3 0.152: v84.86,64.68 v84.86,56.17 84.86,53.75 73.56,42.45 73.56,40.67 72.54,39.66 v69.88,39.66
A12  (via drill 0.2)
  Top 0.152: v80.04,51.34 79.15,51.34 U$8.11 79.02,51.21 v77.5,51.21 | v78.13,67.72 77.88,67.72 77.11,68.49 76.73,68.49 IC4.11 | v57.81,37.37 57.81,31.02 55.65,28.86 53.62,28.86 U$2.21 | v54.51,50.45 54.51,50.96 53.87,51.59 53.49,51.59 U$1.21
  Route3 0.152: v80.04,51.34 80.04,51.72 81.05,52.74 81.05,64.8 v78.13,67.72 | v54.51,50.45 54.38,50.32 54.38,40.8 v57.81,37.37 58.32,37.88 58.32,38.13 62.64,42.45 68.48,42.45 77.24,51.21 v77.5,51.21
A13  (via drill 0.2)
  Top 0.152: v81.56,53.25 80.29,51.98 79.15,51.98 U$8.10 | v81.56,58.83 81.56,61.5 77.11,65.95 76.73,65.95 IC4.13 | v50.7,31.4 52.35,29.75 53.49,29.75 U$2.20 | v52.35,51.85 52.86,52.36 53.37,52.36 U$1.20
  Route3 0.152: v81.56,58.83 v81.56,53.25 81.56,51.85 77.11,47.4 75.59,47.4 74.7,46.51 v74.7,46.13
  Route15 0.152: v50.7,31.4 49.18,31.4 47.65,32.93 47.65,47.15 v52.35,51.85 52.35,52.23 54.38,54.26 58.83,54.26 67.21,45.88 74.07,45.88 74.32,46.13 v74.7,46.13
A14  (via drill 0.2)
  Top 0.152: v78.13,53.12 78.64,52.61 79.02,52.61 U$8.9 | v74.7,60.48 74.7,62.01 76.1,63.41 76.61,63.41 IC4.15 | v54.76,30.77 54.51,30.51 53.62,30.51 U$2.19 | v55.14,52.86 54.76,53.25 53.49,53.25 U$1.19
  Route3 0.152: v78.13,56.67 78.13,57.06 v74.7,60.48
  Route15 0.152: v78.13,56.67 v78.13,53.12 76.99,51.98 76.99,46.77 75.59,45.37 66.95,45.37 66.83,45.5 65.81,45.5 65.56,45.24 | v54.76,30.77 54.76,32.29 65.56,43.09 65.56,45.24 | v55.14,52.86 55.14,52.61 62.51,45.24 65.56,45.24
A15  (via drill 0.2)
  Top 0.152: v80.04,53.25 79.15,53.25 U$8.8 | v80.04,57.18 80.04,59.09 78.26,60.87 76.73,60.87 IC4.17 | v56.92,31.4 56.8,31.27 53.62,31.27 U$2.18 | v54.64,53.75 54.38,54.01 53.49,54.01 U$1.18
  Route3 0.152: v80.04,57.18 v80.04,53.25 80.04,52.99 69.24,42.2 67.97,42.2 65.69,39.91 | v56.92,31.4 57.18,31.4 65.69,39.91 | 65.69,39.91 v63.65,41.94
  Route15 0.152: v54.64,53.75 54.64,51.59 63.65,42.58 v63.65,41.94
ADDR0  (via drill 0.2)
  Top 0.152: v117.5,42.7 119.91,40.29 121.18,40.29 IC20.2 | v105.82,64.17 105.82,65.69 105.69,65.82 IC16.2
  Route3 0.152: v117.5,42.7 117.5,42.96 115.09,45.37 115.09,54.9 v105.82,64.17
ADDR1  (via drill 0.2)
  Top 0.152: v115.85,45.37 115.85,43.59 119.79,39.66 121.18,39.66 IC20.3 | v108.36,64.17 108.36,65.69 108.23,65.82 IC16.4
  Route3 0.152: v115.85,45.37 115.85,56.67 v108.36,64.17
ADDR2  (via drill 0.2)
  Top 0.152: v118.01,40.04 118.39,40.04 119.02,39.4 119.02,39.28 119.91,38.39 121.18,38.39 IC20.5 | v110.77,64.29 110.77,65.82 IC16.6
  Route3 0.152: v118.01,40.04 118.01,57.06 v110.77,64.29
ADDR3  (via drill 0.2)
  Top 0.152: v118.52,39.15 119.91,37.75 121.18,37.75 IC20.6 | v114.07,62.77 114.07,64.68 113.31,65.44 113.31,65.82 IC16.8
  Route3 0.152: v118.52,39.15 118.52,58.33 v114.07,62.77
ADDR4  (via drill 0.2)
  Top 0.152: v122.45,37.12 121.82,36.48 121.31,36.48 IC20.8 | v116.48,74.45 116.48,75.22 115.85,75.85 IC16.11
  Route3 0.152: v122.45,37.12 122.45,65.56 116.48,71.53 v116.48,74.45
ADDR5  (via drill 0.2)
  Top 0.152: v122.96,36.61 122.2,35.85 121.31,35.85 IC20.9 | v118.39,70.39 113.31,75.47 113.31,75.85 IC16.13
  Route3 0.152: v122.96,36.61 122.96,65.82 v118.39,70.39
ADDR6  (via drill 0.2)
  Top 0.152: v122.45,35.21 121.82,34.58 121.31,34.58 IC20.11 | v116.74,69.5 110.77,75.47 110.77,75.85 IC16.15
  Route3 0.152: v122.45,35.21 122.45,36.35 121.44,37.37 121.44,64.8 v116.74,69.5
ADDR7  (via drill 0.2)
  Top 0.152: v117.37,36.74 120.17,33.94 121.18,33.94 IC20.12 | v110.64,67.34 110.64,73.06 108.23,75.47 108.23,75.85 IC16.17
  Route15 0.152: v117.37,36.74 117.37,42.07 115.09,44.36 115.09,62.9 v110.64,67.34
B1
  Top 0.152: IC6.2 88.55,23.65 88.55,28.23 88.93,28.61 88.93,29.62 87.27,31.27 86.89,31.27 IC3.3
B2
  Top 0.152: IC6.3 87.78,23.65 87.78,26.07 84.99,28.86 84.99,33.43 85.37,33.81 86.77,33.81 IC3.5
B3  (via drill 0.2)
  Top 0.152: v86.64,25.94 86.64,23.65 IC6.5 | v88.16,35.72 87.53,35.72 86.89,36.35 IC3.7
  Route15 0.152: v86.64,25.94 86.64,34.2 v88.16,35.72
B4  (via drill 0.2)
  Top 0.152: v86,24.8 86,23.65 IC6.6 | v85.5,36.99 85.5,38.01 86.39,38.89 86.77,38.89 IC3.9
  Route15 0.152: v86,24.8 86,36.48 v85.5,36.99
B5
  Top 0.152: IC6.8 84.61,23.65 84.61,24.29 83.46,25.43 83.34,25.43 79.4,29.37 79.4,37.75 78.26,38.89 76.86,38.89 IC3.12
B6
  Top 0.152: IC6.9 84.1,23.53 84.1,23.02 84.48,22.64 89.31,22.64 89.56,22.89 89.56,32.8 87.78,34.58 82.96,34.58 78,39.53 75.72,39.53 75.46,39.28 75.46,37.24 76.23,36.48 76.73,36.48 IC3.14
B7
  Top 0.152: IC6.11 82.7,23.65 82.7,25.18 79.02,28.86 79.02,32.54 77.75,33.81 76.86,33.81 IC3.16
B8
  Top 0.152: IC6.12 82.07,23.65 82.07,25.43 78.77,28.73 78.77,30.26 77.75,31.27 76.86,31.27 IC3.18
B9
  Top 0.152: IC6.13 81.43,23.65 81.43,25.69 77.62,29.5 75.59,29.5 75.21,29.88 75.21,42.45 75.59,42.83 75.59,44.48 74.19,45.88 74.19,47.4 75.72,48.93 75.72,51.85 79.27,55.4 81.56,55.4 85.75,59.6 86.64,59.6 IC4.3
B10  (via drill 0.2)
  Top 0.152: v73.05,40.93 73.05,28.1 73.18,27.97 77.75,27.97 80.8,24.92 80.8,23.65 IC6.14 | v83.85,58.96 83.85,59.85 86.13,62.14 86.64,62.14 IC4.5
  Route3 0.152: v73.05,40.93 73.05,43.34 76.1,46.39 76.61,46.39 83.85,53.63 v83.85,58.96
B11
  Top 0.152: IC6.16 79.53,23.65 79.53,24.67 76.48,27.72 71.53,27.72 70.64,28.61 70.64,38.51 72.54,40.42 72.54,49.05 79.15,55.66 80.04,55.66 83.34,58.96 83.34,61.88 86.13,64.68 86.64,64.68 IC4.7
B12
  Top 0.152: IC6.17 78.89,23.65 78.89,24.92 78,25.81 76.48,25.81 75.59,26.7 72.16,26.7 70.38,28.48 70.38,38.64 72.03,40.29 72.03,49.18 78.77,55.91 79.27,55.91 79.78,56.42 80.42,56.42 82.83,58.83 82.83,63.91 86.13,67.22 86.64,67.22 IC4.9
B13  (via drill 0.2)
  Top 0.152: v69.75,26.96 74.07,22.64 77.24,22.64 77.62,23.02 77.62,23.53 IC6.19 | v83.08,67.22 76.73,67.22 IC4.12
  Route3 0.152: v69.75,26.96 70.26,26.96 84.61,41.31 84.61,53.12 85.37,53.88 85.37,64.93 v83.08,67.22
B14
  Top 0.152: IC6.20 76.99,23.65 76.99,24.92 75.46,26.45 71.78,26.45 70.13,28.1 70.13,38.77 70.38,39.02 70.38,40.16 69.24,41.31 69.24,43.97 68.73,44.48 68.73,48.42 68.61,48.55 68.61,52.99 71.78,56.17 79.15,56.17 79.66,56.67 80.29,56.67 80.54,56.93 80.54,61.25 77.11,64.68 76.73,64.68 IC4.14
B15  (via drill 0.2)
  Top 0.152: v75.59,24.8 75.72,24.67 75.72,23.65 IC6.22 | v68.73,43.47 68.73,44.1 68.48,44.36 68.48,48.29 68.35,48.42 68.35,53.12 71.65,56.42 72.54,56.42 72.92,56.8 72.92,57.94 75.34,60.36 75.34,61.37 76.1,62.14 76.61,62.14 IC4.16
  Route15 0.152: v75.59,24.8 75.59,36.61 v68.73,43.47
B16  (via drill 0.2)
  Top 0.152: v68.73,33.56 68.73,28.73 72.42,25.05 74.19,25.05 75.08,24.16 75.08,23.65 IC6.23 | v79.15,59.21 77.11,59.21 76.73,59.6 IC4.18
  Route3 0.152: v68.73,33.56 68.73,36.23 67.46,37.5 67.46,38.01 72.54,43.09 72.54,44.74 77.75,49.94 77.88,49.94 80.8,52.86 80.8,57.56 v79.15,59.21
CHIP0  (via drill 0.2)
  Top 0.152: IC20.13 121.18,33.31 119.79,33.31 108.48,44.61 108.1,44.61 IC24.2 | 107.59,44.61 106.83,43.85 106.83,42.96 106.96,42.83 107.21,42.83 110.39,39.66 110.39,33.94 108.86,32.42 107.98,32.42 IC2.1 | 107.59,44.61 107.98,44.61 IC24.2 | v103.4,49.82 102.26,50.96 102.01,50.96 IC24.8 | v105.44,47.78 105.44,46.77 107.59,44.61 | 107.59,44.61 IC24.2
  Route3 0.152: v105.44,47.78 v103.4,49.82
CHIP1  (via drill 0.2)
  Top 0.152: 109.88,45.88 108.1,45.88 IC24.3 107.98,46.01 107.59,46.01 106.83,46.77 106.83,48.93 107.59,49.69 107.98,49.69 IC24.6 | 109.88,45.88 118.14,45.88 125.76,38.26 125.76,36.61 121.82,32.67 121.31,32.67 IC20.14 | v109.88,38.64 109.88,36.35 108.48,34.96 107.98,34.96 IC2.3 | 109.88,45.88 v109.88,45.63
  Route3 0.152: v109.88,45.63 v109.88,38.64
CLK  (via drill 0.2)
  Top 0.152: 42.06,54.9 41.3,55.66 U$4.28 | 42.06,54.9 43.33,53.63 43.33,33.69 42.83,33.18 41.43,33.18 U$3.28 | v119.02,47.15 113.31,52.86 113.06,52.86 IC11.2 112.93,52.86 112.42,53.37 112.42,54.77 109.25,57.94 107.47,57.94 100.74,64.68 100.74,75.22 87.66,88.3 55.91,88.3 44.73,77.12 44.73,57.56 42.06,54.9 | v120.04,29.5 121.18,29.5 IC20.19
  Route3 0.152: v119.02,47.15 119.02,31.02 120.04,30 v120.04,29.5
CLR
  Top 0.152: U$7.12 79.15,44.61 83.72,44.61 84.23,44.1 84.48,44.1 U$7.2 84.61,44.1 86,44.1 86.39,44.48 86.39,45.37 87.91,46.9 | 87.91,46.9 90.96,46.9 IC7.4 | 87.91,46.9 84.86,49.94 84.61,49.94 U$8.2 84.48,50.07 84.1,50.07 83.59,50.58 79.15,50.58 U$8.12
DATA0  (via drill 0.2)
  Top 0.152: v63.02,23.65 63.53,24.16 64.16,24.16 IC8.47 | v88.29,12.48 88.29,13.62 88.42,13.75 IC6.47 | v114.07,18.32 118.77,23.02 120.93,23.02 IC10.2 | v62.89,84.87 64.03,84.87 IC9.47
  Route3 0.152: v63.02,23.65 63.02,22.51 74.7,10.83 86.64,10.83 v88.29,12.48 88.29,12.73 90.96,15.4 103.66,15.4 106.58,18.32 v114.07,18.32
  Route15 0.152: v62.89,84.87 53.75,75.72 53.75,68.49 45.24,59.98 45.24,19.34 52.22,12.35 52.73,12.35 63.02,22.64 v63.02,23.65
DATA1  (via drill 0.2)
  Top 0.152: v65.3,23.78 65.18,23.65 64.29,23.65 IC8.46 | v86.39,11.34 86.64,11.34 87.78,12.48 87.78,13.75 IC6.46 | v115.85,18.96 119.28,22.38 120.93,22.38 IC10.3 | v62.89,84.11 63.02,84.23 64.03,84.23 IC9.46
  Route3 0.152: v65.3,23.78 64.92,23.4 64.92,20.99 74.58,11.34 v86.39,11.34 86.64,11.34 87.78,12.48 87.78,12.73 94.26,19.21 115.09,19.21 115.34,18.96 v115.85,18.96
  Route15 0.152: v62.89,84.11 63.4,84.61 63.4,85.12 63.15,85.38 61.62,85.38 53.62,77.38 51.97,77.38 49.68,75.09 49.68,65.31 44.48,60.1 44.48,19.72 52.6,11.59 53.37,11.59 64.92,23.15 64.92,23.4 v65.3,23.78
DATA2  (via drill 0.2)
  Top 0.152: v67.46,21.11 66.32,22.26 64.29,22.26 IC8.44 | v86,11.97 86.51,12.48 86.51,13.75 IC6.44 | v116.87,19.21 118.77,21.11 120.93,21.11 IC10.5 | v62.89,83.09 64.03,83.09 IC9.44
  Route3 0.152: v67.46,21.11 67.72,21.11 75.84,12.99 75.84,12.48 76.73,11.59 85.62,11.59 v86,11.97 86.39,12.35 86.39,12.61 93.62,19.84 115.72,19.84 116.36,19.21 v116.87,19.21
  Route15 0.152: v62.89,83.09 62.89,83.34 63.65,84.11 63.65,85.25 63.27,85.63 61.49,85.63 53.49,77.63 51.84,77.63 49.43,75.22 49.43,66.96 43.97,61.5 43.97,18.19 51.08,11.08 56.54,11.08 66.57,21.11 v67.46,21.11
DATA3  (via drill 0.2)
  Top 0.152: v65.94,21.75 64.29,21.75 IC8.43 | v85.88,12.73 85.88,13.75 IC6.43 | v113.31,16.8 115.21,16.8 118.9,20.48 120.93,20.48 IC10.6 | v62.89,82.33 64.03,82.33 IC9.43 | v55.78,38.64 58.07,38.64 58.57,38.13 v58.57,27.85
  Route3 0.152: v85.88,12.73 85.37,13.24 76.1,13.24 67.59,21.75 v65.94,21.75 65.94,23.91 65.56,24.29 62.51,24.29 58.95,27.85 v58.57,27.85 | v62.89,82.33 55.91,82.33 55.78,82.46 55.27,82.46 54,81.19 54,40.42 v55.78,38.64
  Route15 0.152: v113.31,16.8 89.94,16.8 v85.88,12.73
DATA4  (via drill 0.2)
  Top 0.152: 84.48,15.27 84.61,15.15 84.61,13.88 IC6.41 | 84.48,15.27 79.4,20.35 64.29,20.35 IC8.41 | v118.01,18.83 118.39,19.21 120.93,19.21 IC10.8 | v90.32,14 88.8,15.53 84.73,15.53 84.48,15.27 | v65.81,81.06 64.16,81.06 IC9.41
  Route3 0.152: 116.74,17.56 114.33,15.15 91.47,15.15 v90.32,14 | 116.74,17.56 v118.01,18.83 | v65.81,81.06 80.8,81.06 82.45,79.41 99.34,79.41 121.18,57.56 121.18,15.4 120.04,14.26 119.66,14.26 118.52,15.4 118.52,15.78 116.74,17.56
DATA5  (via drill 0.2)
  Top 0.152: 83.72,14.76 82.96,14.76 81.43,16.29 79.15,16.29 75.72,19.72 64.29,19.72 IC8.40 | 83.72,14.76 83.97,14.51 83.97,13.88 IC6.40 | v119.28,18.7 120.93,18.7 IC10.9 | 83.72,14.76 v83.97,15.02 | v102.26,59.98 102.26,61.5 93.12,70.64 92.23,70.64 87.4,75.47 87.4,77.5 86.51,78.39 82.19,78.39 80.16,80.42 64.16,80.42 IC9.40
  Route3 0.152: v119.28,18.7 117.88,20.1 115.09,20.1 | 115.09,20.1 89.05,20.1 v83.97,15.02 | v102.26,59.98 102.26,44.36 115.09,31.53 115.09,20.1
DATA6  (via drill 0.2)
  Top 0.152: IC8.38 64.29,18.45 76.61,18.45 79.02,16.03 81.18,16.03 82.7,14.51 82.7,13.88 IC6.38 82.7,13.75 82.58,13.62 v82.58,12.73 | v119.28,17.3 120.93,17.3 IC10.11 | v65.69,79.15 64.16,79.15 IC9.38
  Route3 0.152: v65.69,79.15 98.07,79.15 112.04,65.18 112.8,65.18 120.93,57.06 120.93,16.03 120.17,15.27 119.41,15.27 118.39,16.29 118.39,16.92 118.77,17.3 v119.28,17.3
  Route15 0.152: v119.28,17.3 88.55,17.3 84.48,13.24 83.08,13.24 v82.58,12.73
DATA7  (via drill 0.2)
  Top 0.152: IC8.37 64.29,17.81 76.86,17.81 78.89,15.78 80.8,15.78 82.07,14.51 82.07,13.88 IC6.37 82.07,13.75 82.07,12.48 82.45,12.1 v83.85,12.1 | v118.9,16.67 120.93,16.67 IC10.12 | v65.3,78.52 64.16,78.52 IC9.37
  Route3 0.152: v65.3,78.52 89.81,78.52 103.4,64.93 112.67,64.93 120.68,56.93 120.68,16.16 120.04,15.53 119.53,15.53 118.9,16.16 v118.9,16.67
  Route15 0.152: v118.9,16.67 115.85,16.67 115.47,16.29 101.88,16.29 97.18,11.59 87.4,11.59 86.64,10.83 85.12,10.83 v83.85,12.1
DATA8  (via drill 0.2)
  Top 0.152: IC8.36 64.29,17.18 77.11,17.18 78.77,15.53 80.42,15.53 81.43,14.51 81.43,13.88 IC6.36 81.56,13.75 v81.56,12.73 | v119.79,16.03 120.93,16.03 IC10.13 | v101.75,61.25 92.61,70.39 84.73,70.39 77.24,77.88 64.16,77.88 IC9.36
  Route3 0.152: v101.75,61.25 110.01,52.99 110.01,47.02 114.33,42.7 114.33,33.05 119.28,28.1 119.28,19.46 120.3,18.45 120.3,16.54 v119.79,16.03
  Route15 0.152: v119.79,16.03 104.8,16.03 98.07,9.3 84.1,9.3 81.56,11.84 v81.56,12.73
DATA9  (via drill 0.2)
  Top 0.152: IC8.35 64.29,16.67 74.07,16.67 74.19,16.8 77.11,16.8 78.64,15.27 80.04,15.27 80.8,14.51 80.8,13.88 IC6.35 80.92,13.75 v80.92,12.35 | v118.01,15.4 120.93,15.4 IC10.14 | v65.69,77.25 64.16,77.25 IC9.35
  Route3 0.152: v65.69,77.25 75.84,77.25 90.2,62.9 v90.2,55.15
  Route15 0.152: v80.92,12.35 80.92,11.72 84.1,8.54 84.61,8.54 84.73,8.67 97.82,8.67 104.55,15.4 v118.01,15.4 119.91,15.4 120.3,15.78 120.3,18.45 115.09,23.65 115.09,30 106.83,38.26 106.71,38.26 90.2,54.77 v90.2,55.15
DATA10  (via drill 0.2)
  Top 0.152: IC8.33 64.29,15.4 73.18,15.4 74.32,16.54 76.99,16.54 78.51,15.02 79.02,15.02 79.53,14.51 79.53,13.88 IC6.33 79.66,13.75 79.66,12.22 84.35,7.53 85.37,7.53 v89.94,12.1 | v119.02,14.13 120.93,14.13 IC10.16 121.06,14.26 121.69,14.26 121.95,14.51 121.95,23.91 121.69,24.16 v121.69,25.69 | v65.69,75.98 64.16,75.98 IC9.33
  Route3 0.152: v119.02,14.13 91.97,14.13 v89.94,12.1
  Route15 0.152: v65.69,75.98 72.54,75.98 109.37,39.15 110.13,39.15 118.64,30.64 118.64,28.73 v121.69,25.69
DATA11  (via drill 0.2)
  Top 0.152: v119.79,13.49 120.93,13.49 IC10.17 | 93.12,11.08 89.31,11.08 85.5,7.27 84.23,7.27 79.02,12.48 79.02,13.75 IC6.32 78.89,13.88 78.89,14.51 78.64,14.76 78.38,14.76 76.86,16.29 74.45,16.29 72.92,14.76 64.29,14.76 IC8.32 | 93.12,11.08 96.42,7.78 97.31,7.78 97.44,7.91 97.44,8.41 96.8,9.05 96.8,14.26 95.4,15.65 95.4,33.94 100.74,39.28 103.53,39.28 103.91,39.66 103.91,50.58 102.9,51.59 100.1,51.59 98.7,52.99 98.7,54.01 98.45,54.26 97.82,54.26 95.02,57.06 95.02,65.31 90.2,70.14 84.61,70.14 79.4,75.34 64.16,75.34 IC9.32 | 93.12,11.08 v93.24,11.08
  Route3 0.152: v119.79,13.49 95.66,13.49 v93.24,11.08
DATA12  (via drill 0.2)
  Top 0.152: IC8.30 64.29,13.49 72.03,13.49 74.58,16.03 76.1,16.03 77.62,14.51 77.62,13.88 IC6.30 77.75,13.75 v77.75,12.73 | v105.82,18.32 107.34,18.32 113.56,12.1 118.9,12.1 119.02,12.22 120.93,12.22 IC10.19 | v91.85,19.59 91.85,46.77 94.51,49.44 94.51,65.44 90.07,69.88 74.96,69.88 74.83,69.76 71.65,69.76 67.34,74.07 64.16,74.07 IC9.30
  Route15 0.152: 91.85,18.32 89.18,18.32 84.35,13.49 78.51,13.49 v77.75,12.73 | 91.85,18.32 v105.82,18.32 | 91.85,18.32 v91.85,19.59
DATA13  (via drill 0.2)
  Top 0.152: IC8.29 64.29,12.86 71.78,12.86 74.7,15.78 75.72,15.78 76.99,14.51 76.99,13.88 IC6.29 77.11,13.75 77.11,12.61 77.37,12.35 v77.37,12.1 | v119.41,11.59 120.93,11.59 IC10.20 | v92.48,50.83 92.48,65.56 88.42,69.63 75.08,69.63 74.96,69.5 71.53,69.5 67.59,73.44 64.16,73.44 IC9.29
  Route15 0.152: v119.41,11.59 112.42,11.59 108.36,7.53 83.85,7.53 79.78,11.59 77.88,11.59 v77.37,12.1 77.24,12.22 77.24,12.99 79.78,15.53 84.48,15.53 87.15,18.19 87.15,23.91 96.29,33.05 96.29,40.8 92.48,44.61 v92.48,50.83
DATA14  (via drill 0.2)
  Top 0.152: IC8.27 64.29,11.59 70.89,11.59 74.83,15.53 75.34,15.53 75.72,15.15 75.72,13.88 IC6.27 75.84,13.75 75.84,12.48 80.8,7.53 v83.08,7.53 | v117.12,10.32 120.93,10.32 IC10.22 | v65.69,72.17 64.16,72.17 IC9.27
  Route3 0.152: v117.12,10.32 110.39,10.32 107.59,7.53 v83.08,7.53
  Route15 0.152: v65.69,72.17 75.08,72.17 108.86,38.39 108.86,37.75 119.28,27.34 119.28,21.11 120.68,19.72 120.68,11.08 119.91,10.32 v117.12,10.32
DATA15  (via drill 0.2)
  Top 0.152: 74.83,12.99 75.08,13.24 75.08,13.75 IC6.26 | 74.83,12.99 72.8,10.95 64.29,10.95 IC8.26 | 111.91,12.61 112.67,12.61 115.47,9.81 120.93,9.81 IC10.23 | 111.91,12.61 111.02,11.72 111.02,9.81 107.09,5.87 102.13,5.87 101.88,6.13 81.69,6.13 74.83,12.99 | v65.3,71.53 64.16,71.53 IC9.26 | v106.96,17.81 106.96,17.56 111.91,12.61
  Route15 0.152: v65.3,71.53 78.51,58.33 78.51,58.2 79.02,57.69 86.89,57.69 106.58,38.01 106.71,38.01 106.96,37.75 v106.96,17.81
DI0  (via drill 0.2)
  Top 0.152: U$3.14 47.27,41.56 51.08,41.56 52.48,40.16 53.49,40.16 U$2.7 53.62,40.04 53.87,40.04 54.26,39.66 v56.29,39.66 | v57.81,38.13 58.32,37.62 58.32,37.12 58.07,36.86 58.07,27.34 55.02,24.29 54.51,24.29 IC8.2
  Route3 0.152: v56.29,39.66 v57.81,38.13
DI1
  Top 0.152: U$3.13 47.27,40.93 51.33,40.93 52.99,39.28 53.49,39.28 U$2.8 53.62,39.15 57.94,39.15 59.08,38.01 59.08,27.59 55.14,23.65 54.51,23.65 IC8.3
DI2  (via drill 0.2)
  Top 0.152: 52.73,38.51 51.33,39.91 49.56,39.91 49.18,40.29 47.27,40.29 U$3.12 | 52.73,38.51 53.49,38.51 U$2.9 | v53.24,22.26 54.38,22.26 IC8.5 | 52.73,38.51 v52.48,38.26
  Route15 0.152: v53.24,22.26 53.75,22.77 53.75,36.99 v52.48,38.26
DI3
  Top 0.152: U$2.10 53.49,37.75 51.46,37.75 49.56,39.66 47.27,39.66 U$3.11 47.14,39.66 46.89,39.66 45.62,38.39 45.62,32.29 46.89,31.02 46.89,26.19 50.45,22.64 50.95,22.64 51.84,21.75 54.38,21.75 IC8.6
DI4  (via drill 0.2)
  Top 0.152: 49.3,32.04 46.25,32.04 45.87,32.42 45.87,38.01 46.76,38.89 47.14,38.89 U$3.10 | 49.3,32.04 51.84,34.58 51.84,34.96 52.1,35.21 53.49,35.21 U$2.13 | v50.7,22.13 52.35,20.48 54.38,20.48 IC8.8 | v50.7,23.15 50.7,30.64 49.3,32.04
  Route3 0.152: v50.7,23.15 v50.7,22.13
DI5  (via drill 0.2)
  Top 0.152: v48.16,38.26 47.27,38.26 U$3.9 | v52.35,34.7 53.37,34.7 53.49,34.58 U$2.14 | v53.24,19.97 53.37,19.84 54.38,19.84 IC8.9
  Route3 0.152: v48.16,38.26 48.79,38.26 v52.35,34.7
  Route15 0.152: v53.24,19.97 53.24,20.35 52.73,20.86 52.73,32.8 52.86,32.93 52.86,34.2 v52.35,34.7
DI6  (via drill 0.2)
  Top 0.152: v48.54,37.62 47.27,37.62 U$3.8 | v52.35,33.94 53.24,33.94 53.49,33.69 U$2.15 | v52.73,18.57 54.38,18.57 IC8.11
  Route3 0.152: v48.54,37.62 52.22,33.94 v52.35,33.94 52.86,33.43 52.86,32.93 52.73,32.8 v52.73,18.57
DI7  (via drill 0.2)
  Top 0.152: v48.16,36.99 47.27,36.99 U$3.7 | v52.35,33.18 53.24,33.18 53.49,32.93 U$2.16 | v53.24,17.94 54.38,17.94 IC8.12
  Route3 0.152: v48.16,36.99 48.54,36.99 v52.35,33.18
  Route15 0.152: v53.24,17.94 52.6,17.94 52.22,18.32 52.22,33.05 v52.35,33.18
DI8  (via drill 0.2)
  Top 0.152: v46.38,32.67 46.38,35.97 46.76,36.35 47.14,36.35 U$3.6 | v46.38,30.77 46.38,24.8 52.22,18.96 52.22,18.19 53.11,17.3 54.38,17.3 IC8.13 | v62.38,31.27 63.91,32.8 64.67,32.8 U$2.29
  Route3 0.152: v46.38,30.77 v46.38,32.67
  Route15 0.152: v62.38,31.27 62.38,26.32 53.49,17.43 51.08,17.43 50.57,17.94 50.57,21.5 46.38,25.69 v46.38,30.77
DI9  (via drill 0.2)
  Top 0.152: v48.16,35.72 47.27,35.72 U$3.5 | v51.72,18.7 51.72,18.32 53.37,16.67 54.38,16.67 IC8.14 | v59.08,26.58 59.46,26.96 59.46,29.12 63.91,33.56 64.67,33.56 U$2.30
  Route3 0.152: v48.16,35.72 48.16,34.7 51.72,31.15 v51.72,18.7 52.99,17.43 53.49,17.43 59.08,23.02 v59.08,26.58
DI10  (via drill 0.2)
  Top 0.152: v50.57,37.75 50.32,37.75 49.81,37.24 49.81,36.61 48.41,35.21 47.27,35.21 U$3.4 | v59.72,34.7 64.54,34.7 64.67,34.58 U$2.31 | v51.21,18.07 51.21,17.3 53.11,15.4 54.38,15.4 IC8.16
  Route3 0.152: v50.57,37.75 56.67,37.75 v59.72,34.7
  Route15 0.152: v51.21,18.07 51.21,37.12 v50.57,37.75
DI11  (via drill 0.2)
  Top 0.152: v48.16,33.94 47.65,34.45 47.27,34.45 U$3.3 | v50.06,18.07 53.37,14.76 54.38,14.76 IC8.17 | v62.38,41.43 62.13,41.18 62.13,37.5 64.29,35.34 64.67,35.34 U$2.32
  Route3 0.152: v48.16,33.94 50.06,32.04 v50.06,18.07
  Route15 0.152: v62.38,41.43 53.87,41.43 50.7,38.26 50.32,38.26 48.67,36.61 48.67,34.45 v48.16,33.94
DI12  (via drill 0.2)
  Top 0.152: v48.16,33.18 47.52,33.81 47.27,33.81 U$3.2 | v52.48,13.62 54.26,13.62 54.38,13.49 IC8.19 | v65.81,37.62 64.8,37.62 U$2.35
  Route3 0.152: v48.16,33.18 48.16,17.94 v52.48,13.62
  Route15 0.152: v65.81,37.62 66.83,36.61 66.83,30.39 52.48,16.03 v52.48,13.62
DI13  (via drill 0.2)
  Top 0.152: v47.27,32.54 47.27,33.05 U$3.1 | v52.48,12.86 54.38,12.86 IC8.20 | v66.32,38.39 64.8,38.39 U$2.36
  Route3 0.152: v47.27,32.54 47.27,18.07 v52.48,12.86
  Route15 0.152: v66.32,38.39 66.32,37.5 67.08,36.74 67.08,28.48 53.49,14.89 53.49,13.88 v52.48,12.86
DQ0
  Top 0.152: IC9.2 54.26,84.87 53.75,84.87 47.14,78.26 47.14,64.17 U$4.14 47.02,64.04 46.13,64.04 45.37,63.28 45.37,56.04 51.72,49.69 55.4,49.69 57.05,51.34 57.05,60.1 54.38,62.77 53.49,62.77 U$1.7
DQ1
  Top 0.152: IC9.3 54.26,84.23 53.75,84.23 48.29,78.77 48.29,64.42 47.4,63.53 47.14,63.53 U$4.13 47.02,63.41 45.87,63.41 45.62,63.15 45.62,56.17 51.84,49.94 55.27,49.94 56.8,51.47 56.8,59.98 54.76,62.01 53.49,62.01 U$1.8
DQ2
  Top 0.152: 49.81,62.77 51.46,62.77 52.86,61.37 53.37,61.37 U$1.9 | 49.81,62.77 47.14,62.77 U$4.12 | 49.81,62.77 49.81,64.68 50.83,65.69 50.83,71.53 50.7,71.66 50.7,80.3 53.37,82.96 54.26,82.96 IC9.5
DQ3  (via drill 0.2)
  Top 0.152: U$4.11 47.14,62.14 51.33,62.14 52.99,60.48 53.37,60.48 U$1.10 53.49,60.48 53.75,60.48 54.51,61.25 v54.51,61.5 | v55.53,81.69 54.89,82.33 54.38,82.33 IC9.6
  Route3 0.152: v55.53,81.69 55.53,81.19 54.51,80.17 v54.51,61.5
DQ4  (via drill 0.2)
  Top 0.152: 51.46,58.71 51.72,58.71 52.35,58.07 53.37,58.07 U$1.13 | 51.46,58.71 49.94,58.71 49.81,58.83 49.81,59.09 47.4,61.5 47.14,61.5 U$4.10 | v53.24,80.55 53.75,81.06 54.26,81.06 IC9.8 | 51.46,58.71 v51.46,59.09
  Route3 0.152: v53.24,80.55 53.75,80.04 53.75,62.14 51.46,59.85 v51.46,59.09
DQ5  (via drill 0.2)
  Top 0.152: U$4.9 47.14,60.87 47.4,60.87 49.81,58.45 49.81,56.8 50.32,56.29 52.1,56.29 52.99,57.18 53.37,57.18 U$1.14 53.49,57.31 53.75,57.31 55.02,58.58 v55.02,60.87 | v55.53,80.42 54.38,80.42 IC9.9
  Route3 0.152: v55.53,80.42 55.53,64.29 55.02,63.79 v55.02,60.87
DQ6  (via drill 0.2)
  Top 0.152: U$1.15 53.37,56.42 52.99,56.42 52.6,56.04 50.19,56.04 49.05,57.18 49.05,58.71 47.65,60.1 47.14,60.1 U$4.8 47.02,60.23 46.76,60.23 46.13,60.87 v46.13,62.9 | v53.24,79.03 53.37,79.15 54.26,79.15 IC9.11
  Route3 0.152: v53.24,79.03 53.24,78.26 46.13,71.15 v46.13,62.9
DQ7  (via drill 0.2)
  Top 0.152: U$1.16 53.37,55.66 50.06,55.66 48.79,56.93 48.79,58.58 47.91,59.47 47.14,59.47 U$4.7 47.02,59.6 46.64,59.6 v46.13,60.1 | v52.22,78.52 54.26,78.52 IC9.12
  Route3 0.152: v52.22,78.52 51.97,78.52 45.62,72.17 45.62,60.61 v46.13,60.1
DQ8  (via drill 0.2)
  Top 0.152: v46.13,58.33 46.64,58.83 47.02,58.83 U$4.6 | v61.11,54.77 63.4,54.77 64.29,55.66 64.54,55.66 U$1.29 | v52.35,76.61 53.62,77.88 54.26,77.88 IC9.13
  Route3 0.152: v52.35,76.61 52.35,76.11 46.64,70.39 46.64,58.83 v46.13,58.33
  Route15 0.152: v46.13,58.33 46.13,56.93 48.29,54.77 v61.11,54.77
DQ9  (via drill 0.2)
  Top 0.152: v48.03,58.58 47.78,58.33 47.14,58.33 U$4.5 | v63.53,56.8 64.29,56.8 64.54,56.55 U$1.30 | v64.54,69.12 56.41,77.25 54.38,77.25 IC9.14
  Route3 0.152: v64.54,69.12 64.54,57.82 v63.53,56.8
  Route15 0.152: v48.03,58.58 51.46,58.58 51.97,58.07 62.89,58.07 63.15,58.33 63.65,58.33 63.91,58.07 63.91,57.18 v63.53,56.8
DQ10  (via drill 0.2)
  Top 0.152: v48.29,57.56 47.14,57.56 U$4.4 | v62.89,57.31 64.54,57.31 U$1.31 | v52.48,75.47 52.99,75.98 54.26,75.98 IC9.16
  Route3 0.152: v52.48,75.47 52.48,75.09 50.83,73.44 50.83,62.26 48.79,60.23 48.79,58.07 v48.29,57.56
  Route15 0.152: v48.29,57.56 62.64,57.56 v62.89,57.31
DQ11  (via drill 0.2)
  Top 0.152: v48.03,56.8 47.91,56.93 47.14,56.93 U$4.3 | v63.4,57.82 64.41,57.82 64.54,57.94 U$1.32 | v53.24,75.47 54.26,75.47 IC9.17
  Route3 0.152: v53.24,75.47 53.24,75.09 53.37,74.96 53.37,73.82 51.08,71.53 51.08,62.14 49.05,60.1 49.05,57.56 48.29,56.8 v48.03,56.8
  Route15 0.152: v48.03,56.8 48.03,57.06 47.78,57.31 47.78,57.82 48.03,58.07 51.59,58.07 51.84,57.82 v63.4,57.82
DQ12  (via drill 0.2)
  Top 0.152: v49.3,55.28 48.29,56.29 47.14,56.29 U$4.2 | 61.37,56.29 62.38,57.31 62.38,58.58 64.16,60.36 64.54,60.36 U$1.35 | 61.37,56.29 v61.11,56.04 | 61.37,56.29 60.86,56.8 60.86,61.37 52.35,69.88 52.35,73.18 53.24,74.07 54.26,74.07 IC9.19
  Route15 0.152: v49.3,55.28 60.35,55.28 v61.11,56.04
DQ13  (via drill 0.2)
  Top 0.152: v48.03,55.79 47.14,55.79 U$4.1 | v61.37,57.06 61.37,58.33 63.53,60.48 | 63.53,60.48 64.29,61.25 64.54,61.25 U$1.36 | 63.53,60.48 52.6,71.41 52.6,73.06 52.99,73.44 54.26,73.44 IC9.20
  Route15 0.152: v48.03,55.79 60.1,55.79 v61.37,57.06
GND  (via drill 0.2)
  Top 0.152: C22.2 69.37,35.97 69.37,28.48 72.54,25.31 75.97,25.31 76.35,24.92 v76.38,24.83 | 49.68,14.13 C20.2 | v65.23,72.88 65.17,72.83 IC9.28 | v56.23,72.78 54.4,72.78 IC9.21 | IC9.15 53.27,76.64 v53.23,76.68 | IC9.34 65.17,76.64 v65.23,76.58 | IC9.39 65.2,79.81 v65.23,79.78 | IC9.45 65.19,83.62 v65.23,83.58 | IC9.10 54.33,79.78 v52.93,79.78 | v65.43,22.88 64.28,22.88 IC8.45 | IC8.21 54.5,12.28 v55.53,12.28 | IC8.28 65.31,12.2 v65.33,12.18 | IC8.34 65.3,16.01 v65.33,15.98 | IC8.39 v65.33,19.18 | v53.23,23.08 54.33,23.08 IC8.4 | v53.33,19.18 IC8.10 | v53.23,16.08 54.34,16.08 IC8.15 | IC9.4 55.99,83.62 v56.03,83.58 | C41.2 15.93,44.68 v14.98,44.68
  Top 0.2: IC5.3 11.43,81.08 v11.43,81.78 | IC11.3 v113.83,53.58 | C37.2 v17.43,12.83 | IC15.3 20.45,18.7 v20.48,18.73 | IC4.1 88.14,57.17 v88.18,57.13 | U$8.7 85.42,53.18 v85.48,53.23 | IC4.10 88.19,68.6 v88.23,68.63 | U$7.7 85.44,47.25 v85.48,47.28
  Top 0.203: IC10.25 131.86,9.06 v131.88,9.08 | IC10.28 131.91,10.97 v131.93,10.98 | IC10.34 v131.87,14.78 v131.88,14.78 | IC10.39 131.85,17.95 v131.88,17.98 | IC10.45 131.86,21.76 v131.88,21.78 | IC10.48 131.86,23.67 v131.88,23.68 | IC10.1 120.94,23.63 v119.78,23.63 | IC10.4 119.8,21.76 v119.78,21.78 | IC10.10 119.8,17.95 v119.78,17.93 | IC10.15 v119.83,14.78 | IC10.21 119.84,10.97 v119.83,10.98 | IC10.24 119.85,9.06 v119.83,9.08 | C24.2 v115.59,12.87 v115.58,12.88 | IC18.3 v112.08,12.03 | IC13.3 98.59,8.18 v99.28,8.18 | C17.2 101.08,5.21 v101.08,4.23 | IC14.3 98.05,14.6 v98.08,14.63 | C18.2 v100.77,15.87 v100.78,15.88 | IC1.7 109.4,28.25 v109.43,28.28 | v120.13,26.28 121.24,26.28 IC20.24 | v120.13,28.18 121.24,28.18 IC20.21 | v120.08,31.98 IC20.15 | C25.2 115.67,30.09 v115.63,30.13 | v120.08,35.13 120.1,35.15 IC20.10 | v120.08,38.98 121.24,38.98 IC20.4 | v120.08,40.88 121.24,40.88 IC20.1 | IC20.48 132.16,40.87 v132.18,40.88 | IC20.45 132.15,38.96 v132.18,38.93 | IC20.39 132.16,35.15 v132.18,35.13 | IC20.34 v132.17,31.98 v132.18,31.98 | IC20.28 132.16,28.17 v132.18,28.18 | IC20.25 132.16,26.26 v132.18,26.28 | R22.1 113.35,60.11 v113.28,60.18 112.03,60.18 R21.1 110.7,60.16 v110.63,60.23 109.55,60.23 R20.1 108.27,60.19 v108.23,60.23 108.2,60.2 R19.1 | IC16.10 115.84,64.35 v115.83,64.33 | IC16.1 104.41,64.45 v104.43,64.43 | C36.2 100.36,77.65 v100.33,77.68 | R26.1 108.17,81.49 v108.23,81.43 108.3,81.5 R25.1 110.71,81.5 v110.78,81.43 110.82,81.47 R24.1 113.24,81.47 v113.28,81.43 114.5,81.43 R23.1 | C32.2 92.98,79.17 v92.98,78.28 93.37,77.89 C13.2 | C13.2 93.79,77.33 v94.53,77.33 | C13.2 94.1,76.91 v94.53,76.48
  Top 0.203: C19.2 v48.84,74.67 v48.83,74.68 | v52.33,63.68 53.37,63.68 U$1.6 | v52.28,58.88 53.37,58.88 U$1.12 | U$4.16 40.69,63.47 v40.38,63.78 40.71,64.12 U$4.15 | C4.1 37.3,64.28 v36.38,64.28 | U$4.20 40.34,60.87 v40.33,60.88 | U$4.26 40.34,56.97 v40.33,56.98 | C40.2 50.53,57.84 v50.53,56.88 | C2.2 v36.53,56.43 | C11.2 v36.48,58.53 | R5.2 v36.44,62.17 v36.43,62.18 | v34.58,64.68 34.61,64.65 R8.2 | R9.1 34.63,55.77 v34.63,54.98 | R12.1 16.13,41.73 v16.08,41.78 | R7.1 v35.13,42.33 | C3.1 v36.63,41.78 | R4.2 37.54,39.63 v36.68,39.63 | C12.2 36.65,36.21 v36.58,36.28 | v40.48,38.38 41.32,38.38 U$3.20 | v40.48,40.98 41.32,40.98 U$3.16 | v40.48,41.63 41.32,41.63 U$3.15 | v40.48,34.48 41.32,34.48 U$3.26 | C1.2 v36.59,34.12 v36.58,34.13 36.05,33.6 R6.2 v35.13,32.73 | R14.2 22.54,35.53 v23.58,35.53 | C39.2 50.63,34.98 v50.63,34.13 | v52.53,40.83 52.55,40.85 U$2.6 | U$2.34 65.81,36.85 v65.83,36.83 | U$2.39 65.81,40.85 v65.83,40.83 | U$2.40 65.81,41.65 v65.83,41.63 | U$2.12 52.56,36.05 v52.53,36.08 | U$1.34 64.66,59.68 v65.98,59.68 | C26.2 71.12,57.19 v71.08,57.23 | C21.2 v69.83,58.83 | U$1.39 64.66,63.68 v65.78,63.68 | U$1.40 64.66,64.48 v65.78,64.48 | C34.2 73.86,49.35 v73.83,49.38 | C35.2 v73.83,43.43 | v76.38,24.83 76.4,24.81 IC6.21 | v73.93,23.68 73.99,23.62 IC6.24 | v71.23,28.73 71.25,28.71 C27.2 | C20.2 v48.78,14.13 | IC6.28 76.4,12.66 v76.38,12.63 | IC6.34 80.21,12.67 v80.18,12.63 | IC6.39 v83.39,12.69 v83.38,12.68 | C38.2 v85.27,8.14 v85.28,8.13 | IC6.45 87.2,12.65 v87.18,12.63 | C23.2 v91.89,6.87 v91.88,6.88 | C29.2 96.2,20.61 v96.18,20.63 | IC6.1 89.08,23.64 v89.08,24.73 | IC6.4 87.18,23.64 v87.18,24.78 | IC6.10 v83.39,24.77 v83.38,24.78
  Top 0.203: IC6.15 80.21,24.75 v80.18,24.78 | IC3.1 v88.32,28.74 v88.33,28.73 | IC3.10 88.26,40.17 v88.33,40.23 | C30.2 v95.84,43.37 v95.83,43.38 | R1.2 v92.69,41.14 v92.68,41.13 | IC7.3 v93.48,46.78 | C31.2 v96.78,53.58 | U$5.4 109.02,57.44 v109.08,57.38 | IC24.7 v109.43,50.98 | IC2.7 v109.37,39.92 v109.38,39.93 | C28.2 v96.24,32.27 v96.23,32.28 | U$6.9 19.58,45.34 | 19.58,45.34 v19.58,44.58 | U$6.10 19.58,45.34 | U$6.13 21.85,44.91 v22.18,44.58 22.5,44.91 U$6.14 | U$6.3 22.48,51.23 | 22.48,51.23 v22.48,52.18 | U$6.4 21.88,51.23 22.48,51.23
  Top 0.406: R18.1 19.43,61.58 v18.88,61.58 18.93,61.53 U$12.P$4 | U$6.EXP 21.53,48.23 v21.48,48.18
  Top 0.508: v81.58,74.28 C14.2 83.33,74.56 v83.33,75.53 83.63,75.84 U$9.1 v82.48,76.97 v82.48,76.98
  other vias: 72.43,67.13 60.93,48.23 20.08,49.58 20.78,49.58 21.48,49.58 22.18,49.58 22.88,49.58 21.48,48.88 20.78,48.88 20.08,48.88 22.18,48.88 22.88,48.88 22.88,48.18 22.18,48.18 20.78,48.18 20.08,48.18 20.08,47.48 20.78,47.48 21.48,47.48 22.18,47.48 22.88,47.48
  pour GND: 0.53,99.53 159.53,99.53 159.53,0.53 0.53,0.53
  pour Route3: 8.03,96.03 8.03,91.03 8.03,90.03 1.03,90.03 1.03,10.03 8.03,10.03 8.03,4.03 154.03,4.03 154.03,9.03 159.03,9.03 159.03,91.03 153.03,91.03 153.03,96.03
  pour Route15: 8.03,96.03 8.03,90.03 1.03,90.03 1.03,10.03 8.03,10.03 8.03,4.03 154.03,4.03 154.03,9.03 159.03,9.03 159.03,91.03 153.03,91.03 153.03,96.03
  pour VCC: 19.63,50.03 19.63,46.83 23.43,46.83 23.43,50.03
IBN
  Top 0.152: 23.33,53.21 R11.2 C10.1 23.73,56.46 L7.2
  Top 0.203: 23.33,53.21 23.15,53.04 U$6.2
IBP
  Top 0.152: 24.59,52.77 R11.1 C10.2 25.68,58.11 L8.2
  Top 0.203: U$6.1 23.8,51.99 24.59,52.77
IS_EQUAL
  Top 0.152: IC7.2 92.74,46.01 98.96,46.01 100.23,44.74 101.88,44.74 IC24.13
N$1
  Top 0.203: U$6.11 20.55,43.38 C33.1
N$2  (via drill 0.2)
  Top 0.152: v132.61,23.65 132.11,23.15 130.84,23.15 IC10.47
  Route3 0.152: v132.61,23.65 132.61,25.94 132.74,26.07 132.74,72.68 149.51,89.44 J1.C1
N$3  (via drill 0.2)
  Top 0.152: v131.85,22.51 130.84,22.51 IC10.46
  Route3 0.152: v131.85,22.51 132.23,22.51 133.76,24.04 133.76,61.63 147.85,75.72 147.85,85.12 149.51,86.77 J1.C2
N$4
  Top 0.152: 103.28,7.14 103.28,6.89 103.53,6.64 R15.2 103.28,7.14 | 103.28,7.14 103.28,8.54 D1.C | IC13.2 98.58,7.4 100.74,7.4 100.99,7.14 C17.1 101.12,7.14 103.28,7.14
N$5  (via drill 0.2)
  Top 0.152: v129.82,24.29 129.82,21.5 130.07,21.24 130.71,21.24 IC10.44
  Route15 0.152: v129.82,24.29 129.82,64.68 149.51,84.36 J1.C3
N$6  (via drill 0.2)
  Top 0.152: v131.85,20.99 131.47,20.61 130.84,20.61 IC10.43
  Route15 0.152: v131.85,20.99 133.5,22.64 133.5,61.75 148.62,76.87 148.62,80.8 149.51,81.69 J1.C4
N$7  (via drill 0.2)
  Top 0.152: v132.87,21.24 132.87,20.1 132.11,19.34 130.84,19.34 IC10.41
  Route3 0.152: v132.87,21.24 148.11,36.48 148.11,77.76 149.51,79.15 J1.C5
N$8  (via drill 0.2)
  Top 0.152: v131.85,18.7 130.84,18.7 IC10.40
  Route15 0.152: v131.85,18.7 131.85,19.08 133.76,20.99 133.76,60.87 149.51,76.61 J1.C6
N$9  (via drill 0.2)
  Top 0.152: v134.27,26.19 134.27,19.59 132.11,17.43 130.84,17.43 IC10.38